# Altium project HU_revB.PrjPcb (part 3 of 4)

## Sheet MCP2515_PINOUT.SchDoc
size A; SheetNumber: 7; SheetTotal: 17
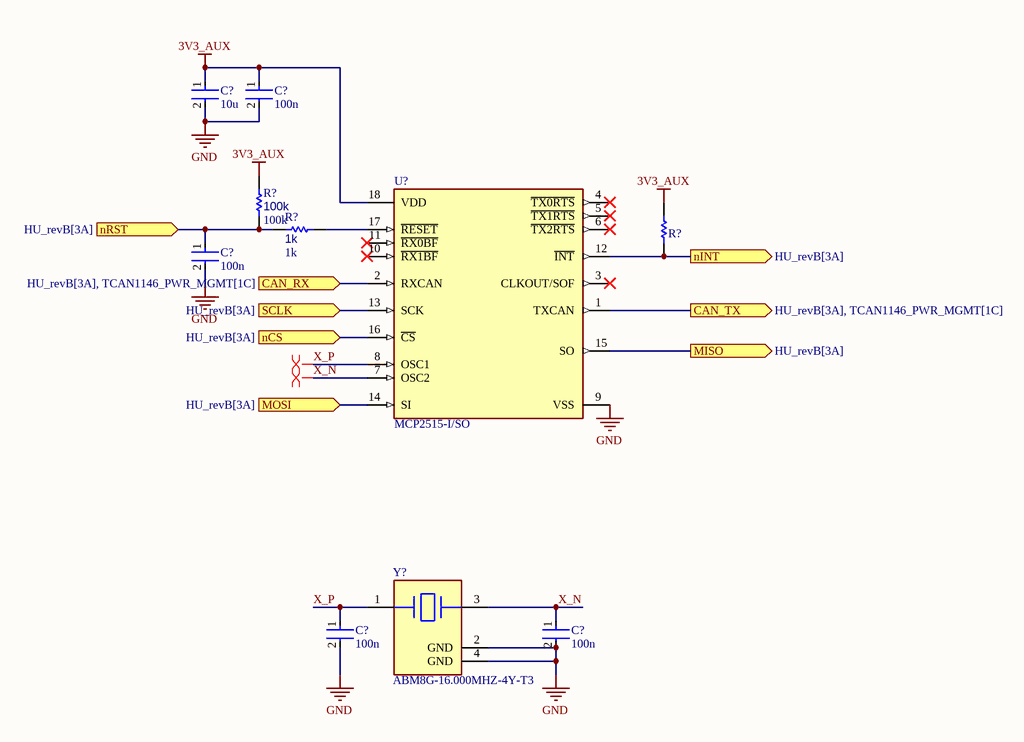
[diagram p8: MCP2515_PINOUT.SchDoc]

### Parts
C55  10u  [FP-0402-L_1_0_0_05-W_0_5-IPC_A]
C56  100n  [FP-0402-L_1_0_0_05-W_0_5-IPC_A]
C57  100n  [FP-0402-L_1_0_0_05-W_0_5-IPC_A]
C58  100n  [FP-0402-L_1_0_0_05-W_0_5-IPC_A]
C59  100n  [FP-0402-L_1_0_0_05-W_0_5-IPC_A]
R62  100k  [R0603B]
R64  1k  [R0603B]
R65  ERJ3EKF1002V  [RESC1609X55X30LL15T15]  (value not drawn)
U6  MCP2515-I/SO  [FP-C04-051-MFG]
Y3  ABM8G-16.000MHZ-4Y-T3  [FP-ABM8G-MFG]

### Ports
CAN_RX (in, see HU_revB[3A], TCAN1146_PWR_MGMT[1C]), CAN_TX (out, see HU_revB[3A], TCAN1146_PWR_MGMT[1C]), MISO (out, see HU_revB[3A]), MOSI (in, see HU_revB[3A]), nCS (in, see HU_revB[3A]), nINT (out, see HU_revB[3A]), nRST (in, see HU_revB[3A]), SCLK (in, see HU_revB[3A])

### Nets
3V3_AUX: C55.1 C56.1 R62.1 R65.1 U6.18(VDD)  [project net GPIO_VREF]
GND: C55.2 C56.2 C57.2 C58.2 C59.2 U6.9(VSS) Y3.2(GND) Y3.4(GND)
SPI0_MISO: U6.15(SO) ; port MISO
SPI0_MOSI: U6.14(SI) ; port MOSI
SPI0_nCS0: U6.16(~{CS}) ; port nCS
SPI0_SCLK: U6.13(SCK) ; port SCLK
X_N: C59.1 U6.7(OSC2) Y3.3
X_P: C58.1 U6.8(OSC1) Y3.1
NetC57_1: C57.1 R62.2 R64.2 ; port nRST
NetR64_1: R64.1 U6.17(~{RESET})
NetR65_2: R65.2 U6.12(~{INT}) ; port nINT
NetU6_1: U6.1(TXCAN) ; port CAN_TX
NetU6_2: U6.2(RXCAN) ; port CAN_RX

Not connected (* = marked no-connect by the designer): U6 3(CLKOUT/SOF)* 4(~{TX0RTS})* 5(~{TX1RTS})* 6(~{TX2RTS})* 10(~{RX1BF})* 11(~{RX0BF})*

### Layout directives
differential pair: X_N, X_P

### Library data of the parts
C55-C59 = CMP-001-00058-1: LARGE PADS, 0402 CAP, CHANGE COMMENT TO MATCH REAL P/N; Capacitor Type: Ceramic; Min Operating Temperature: -55°C; Mounting Technology: Surface Mount; Pins: 2; Case/Package: 0402; RoHS Compliant: Yes; Max Operating Temperature: 85°C
R62 R64 = CMP-009-00002-14: Resistor
  R?#51: Value: 100k
  R?#53: Value: 1k
R65 = CMP-1012-00623-3: Chip Resistor, 10 KOhm, +/- 1%, 0.1 W, -55 to 155 degC, 0603 (1608 Metric), RoHS, Tape and Reel; Manufacturer: Panasonic; Voltage Rating: 75V; Case\/Package: 0603; Power Rating: 100mW; Resistance: 10KOhm; Temperature Coefficient: 100ppm\/degreesC; Number of Pins: 2; Package Reference: 603; Depth: 0.8mm; Mount: SurfaceMount; Package Description: 2-Pin Surface Mount Device, Body 1.6 x 0.85 mm; Datasheet Version: 02/2017; Length: 1.6mm; Lead Free: LeadFree; Height: 0.45mm; Number of Terminations: 2; Max Power Dissipation: 100mW; Min Operating Temperature: -55degC; Datasheet URL: https://industrial.panasonic.com/cdbs/www-data/pdf/RDA0000/AOA0000C304.pdf; Termination: SMD/SMT; Case Code (Metric): 1608; Case Code (Imperial): 0603; Tolerance: 1%; Max Operating Temperature: 155degC; RoHSCompliant: true; Voltage Rating (DC): 75V; Radiation Hardening: No; Packaging: TapeandReel; Composition: ThickFilm; Mounting Technology: SurfaceMount; Manufacturer URL: http://www.panasonic.com/; Width: 0.031inch; REACH SVHC: NoSVHC; Contact Plating: Tin; Military Standard: Not; Package Quantity: 1
U6 = CMP-0186-00133-3: IC CAN CONTROLLER W/SPI 18SOIC; Manufacturer: Microchip; Min Supply Voltage: 2.7V; Max Supply Voltage: 5.5V; Standoff Height: 0.1mm; Nominal Supply Current: 10mA; Interface: SPI,CAN; Lead Free: Yes; Digikey Description: IC CAN CONTROLLER W/SPI 18SOIC; Category: IC; RoHS: TRUE; Manufacturer Part Number: MCP2515-I/SO; ComponentLink2URL: http://ww1.microchip.com/downloads/en/DeviceDoc/MCP2515-Stand-Alone-CAN-Controller-with-SPI-20001801J.pdf; Mouser Description: CAN Interface IC W/ SPI Interface; Device Class L2: Interface ICs; Package: C04-051; Automotive: No; Function: Controller; Octopart: https://octopart.com/mcp2515-i%2Fso-microchip-430187; Temperature: -40°C to +85°C; Ipc Land Pattern Name: SOIC127P1030X265-18; Ambient Temperature Range Low: -65°C; Height: 2.65mm; Device Class L1: Integrated Circuits (ICs); Ambient Temperature Range High: +125°C; Footprint Url: http://ww1.microchip.com/downloads/en/DeviceDoc/18L_SOIC_Wide_7.50_SO_C04-0051D.pdf; Temperature Range Low: -40°C; Device Class L3: Controllers; Temperature Range High: +85°C; ComponentLink2Description: Datasheet
Y3 = CMP-27762-015134-1: Crystal 16MHz ±30ppm (Tol) ±30ppm (Stability) 10pF FUND 80Ω 4-Pin SMD T/R; Series Resistance: 80R; Mount: Surface Mount; Width: 0.098inch; Load Capacitance: 10pF; Length: 3.2mm; Series: ABM8G; Max Operating Temperature: 60°C; Depth: 2.5mm; Frequency: 16MHz; Frequency Tolerance: 30ppm; Height: 0.039inch; ESR (Equivalent Series Resistance): 80R; Case/Package: SMD/SMT; Lead Free: Lead Free; Frequency Stability: 30ppm; Packaging: Tape and Reel; Number of Pins: 4; REACH SVHC: No SVHC; Min Operating Temperature: -10°C

## Sheet ADC108S022_PINOUT.SchDoc
size A; SheetNumber: 8; SheetTotal: 17
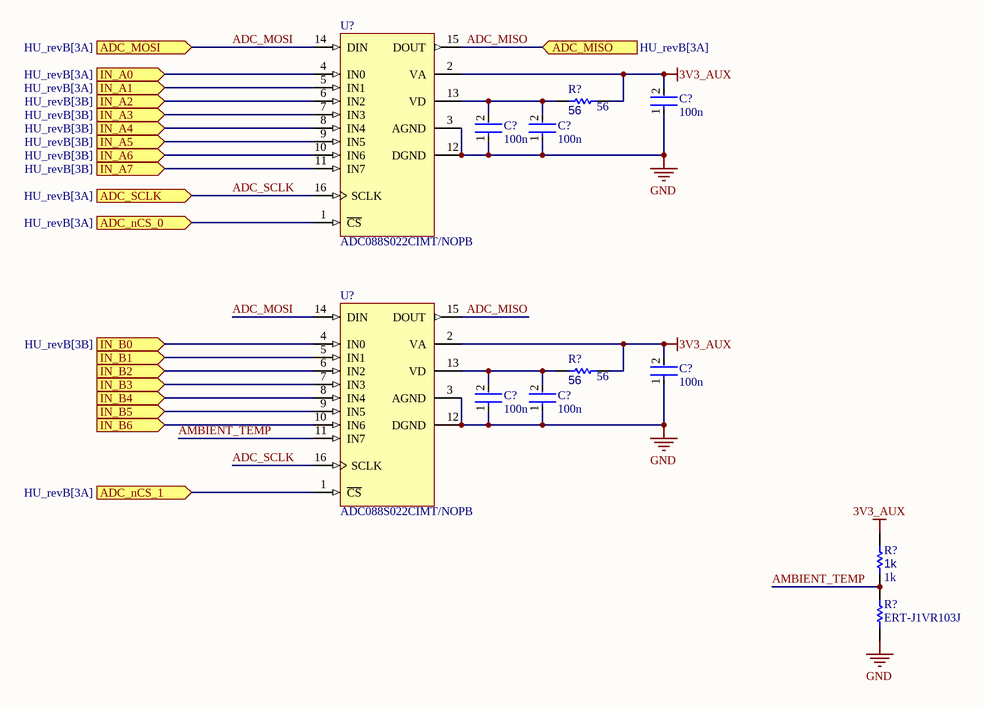
[diagram p9: ADC108S022_PINOUT.SchDoc]

### Parts
C60  100n  [FP-0402-L_1_0_0_05-W_0_5-IPC_A]
C61  100n  [FP-0402-L_1_0_0_05-W_0_5-IPC_A]
C62  100n  [FP-0402-L_1_0_0_05-W_0_5-IPC_A]
C63  100n  [FP-0402-L_1_0_0_05-W_0_5-IPC_A]
C64  100n  [FP-0402-L_1_0_0_05-W_0_5-IPC_A]
C65  100n  [FP-0402-L_1_0_0_05-W_0_5-IPC_A]
R66  56  [R0603B]
R67  56  [R0603B]
R68  1k  [R0603B]
R70  ERT-J1VR103J  [RESC1608X90X30ML15T20]
U9  ADC088S022CIMT/NOPB  [MTC16_L]
U10  ADC088S022CIMT/NOPB  [MTC16_L]

### Ports
ADC_MISO (in, see HU_revB[3A]), ADC_MOSI (in, see HU_revB[3A]), ADC_nCS_0 (in, see HU_revB[3A]), ADC_nCS_1 (in, see HU_revB[3A]), ADC_SCLK (in, see HU_revB[3A]), IN_A0 (in, see HU_revB[3A]), IN_A1 (in, see HU_revB[3A]), IN_A2 (in, see HU_revB[3B]), IN_A3 (in, see HU_revB[3B]), IN_A4 (in, see HU_revB[3B]), IN_A5 (in, see HU_revB[3B]), IN_A6 (in, see HU_revB[3B]), IN_A7 (in, see HU_revB[3B]), IN_B0 (in, see HU_revB[3B]), IN_B1 (in), IN_B2 (in), IN_B3 (in), IN_B4 (in), IN_B5 (in), IN_B6 (in)

### Nets
3V3_AUX: C60.2 C63.2 R66.1 R67.1 R68.1 U9.2(VA) U10.2(VA)  [project net GPIO_VREF]
GND: C60.1 C61.1 C62.1 C63.1 C64.1 C65.1 R70.1 U9.3(AGND) U9.12(DGND) U10.3(AGND) U10.12(DGND)
ADC_MISO: U9.15(DOUT) U10.15(DOUT) ; port ADC_MISO
ADC_MOSI: U9.14(DIN) U10.14(DIN) ; port ADC_MOSI
ADC_SCLK: U9.16(SCLK) U10.16(SCLK) ; port ADC_SCLK
AMBIENT_TEMP: R68.2 R70.2 U10.11(IN7)
AMP_I_SENSE: U10.4(IN0) ; port IN_B0
SPI1_nCS0: U9.1(~{CS}) ; port ADC_nCS_0
SPI1_nCS1: U10.1(~{CS}) ; port ADC_nCS_1
NetC61_2: C61.2 C62.2 R66.2 U9.13(VD)
NetC64_2: C64.2 C65.2 R67.2 U10.13(VD)
NetD45_1: U9.4(IN0) ; port IN_A0
NetR40_2: U9.8(IN4) ; port IN_A4
NetR44_1: U9.7(IN3) ; port IN_A3
NetR46_1: U9.6(IN2) ; port IN_A2
NetR63_1: U9.5(IN1) ; port IN_A1
NetR?#11_2: U9.11(IN7) ; port IN_A7
NetR?#15_1: U9.10(IN6) ; port IN_A6
NetR?#17_1: U9.9(IN5) ; port IN_A5
NetU10_5: U10.5(IN1) ; port IN_B1
NetU10_6: U10.6(IN2) ; port IN_B2
NetU10_7: U10.7(IN3) ; port IN_B3
NetU10_8: U10.8(IN4) ; port IN_B4
NetU10_9: U10.9(IN5) ; port IN_B5
NetU10_10: U10.10(IN6) ; port IN_B6

### Library data of the parts
C60-C65 = CMP-001-00058-1: as C55-C59 on sheet MCP2515_PINOUT; Min Operating Temperature: -55°C; Mounting Technology: Surface Mount; Pins: 2; Case/Package: 0402; RoHS Compliant: Yes; Max Operating Temperature: 85°C
R66-R68 = CMP-009-00002-14: Resistor
  R?#54 R?#55: Value: 56
  R?#56: Value: 1k
R70 = CMP-2000-00869-1: Manufacturer: Panasonic; Part Number: ERT-J1VR103J
U9 U10 = CMP-0054-00372-2: 8-Channel, 50 kSPS to 200 kSPS, 8-Bit A/D Converter, 16-pin TSSOP, Pb-Free; Manufacturer: National Semiconductor; PackageTopMarking: NSUZXYTT*88S022*CIMT; CompType: ADC IC; PowerWise: Y; ComponentLink2URL: http://www.national.com/pf/AD/ADC088S022.html; RoHS: Y; PackageDescription: Molded TSSOP, Jedec, 5 x 4.4 x 0.9mm Body, 16 Lead, 0.65mm Pitch; DatasheetVersion: Feb-2010; PinCount: 16; ComponentLink1Description: ADC088S022 Datasheet; Code_JEDEC: MO-153-AB; ComponentLink3URL: http://www.national.com/packaging/folders/mtc16.html; PackageVersion: revD, Jun-2003; ComponentLink3Description: MTC16 Package Page; RevisionNote: Component URLs added; ComponentLink1URL: http://www.national.com/ds/AD/ADC088S022.pdf; ComponentLink2Description: ADC088S022 Web Page; PackageReference: MTC16

## Sheet SD.SchDoc
size A4; SheetNumber: 9; SheetTotal: 17
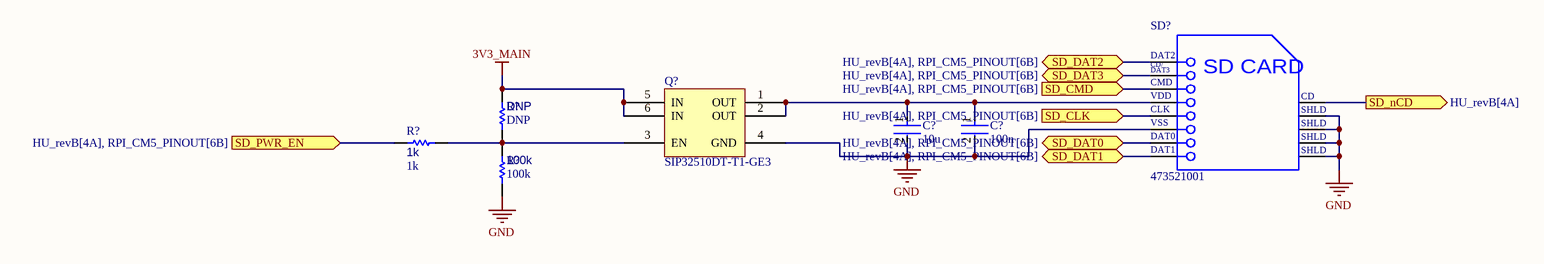
[diagram p10: SD.SchDoc]

### Parts
(Parts that share a designator on the sheet are numbered #1, #2 ... from top to bottom, then left to right.)
C66  10u  [FP-0402-L_1_0_0_05-W_0_5-IPC_A]
C67  100n  [FP-0402-L_1_0_0_05-W_0_5-IPC_A]
Q10  SIP32510DT-T1-GE3  [SOT95P284X110-6N]
R71  DNP  [R0603B]
R?#5  1k  [R0603B]
R?#6  100k  [R0603B]
SD1  473521001  [MOLX-473521001_V]

### Ports
SD_CLK (in, see HU_revB[4A], RPI_CM5_PINOUT[6B]), SD_CMD (in, see HU_revB[4A], RPI_CM5_PINOUT[6B]), SD_DAT0 (bidir, see HU_revB[4A], RPI_CM5_PINOUT[6B]), SD_DAT1 (bidir, see HU_revB[4A], RPI_CM5_PINOUT[6B]), SD_DAT2 (bidir, see HU_revB[4A], RPI_CM5_PINOUT[6B]), SD_DAT3 (bidir, see HU_revB[4A], RPI_CM5_PINOUT[6B]), SD_nCD (out, see HU_revB[4A]), SD_PWR_EN (in, see HU_revB[4A], RPI_CM5_PINOUT[6B])

### Nets
3V3_MAIN: Q10.5(IN) Q10.6(IN) R71.2
GND: C66.2 C67.2 Q10.4(GND) R?#6.1 SD1.6(VSS) SD1.10(SHLD) SD1.11(SHLD) SD1.12(SHLD) SD1.13(SHLD)
SD_CLK: SD1.5(CLK) ; port SD_CLK
SD_CMD: SD1.3(CMD) ; port SD_CMD
SD_DAT0: SD1.7(DAT0) ; port SD_DAT0
SD_DAT1: SD1.8(DAT1) ; port SD_DAT1
SD_DAT2: SD1.1(DAT2) ; port SD_DAT2
SD_DAT3: SD1.2(CD/DAT3) ; port SD_DAT3
SD_PWR_EN: R?#5.2 ; port SD_PWR_EN
NetC66_1: C66.1 C67.1 Q10.1(OUT) Q10.2(OUT) SD1.4(VDD)
NetQ10_3: Q10.3(EN) R71.1 R?#5.1 R?#6.2
NetSD1_9: SD1.9(CD) ; port SD_nCD

### Notes on the sheet
- (in symbol CMP-2000-05848-1) CD/; DAT3; SD CARD

### Library data of the parts
C66 C67 = CMP-001-00058-1: as C55-C59 on sheet MCP2515_PINOUT; Min Operating Temperature: -55°C; Mounting Technology: Surface Mount; Pins: 2; Case/Package: 0402; RoHS Compliant: Yes; Max Operating Temperature: 85°C
Q10 = CMP-019-00054-1: Power Switch ICs – Power Distribution; VISHAY; SIP32510DT-T1-GE3; 1; 1; 5.5 V; SOT-23-6; Max Supply Voltage: 5.5V; Max Power Dissipation: 833mW; Min Supply Voltage: 1.2V; Case/Package: SOT-23-6; Mounting Technology: Surface Mount; Max Operating Temperature: 85°C; Min Operating Temperature: -40°C
R71 R?#5 R?#6 = CMP-009-00002-14: Resistor
  R?#58: Value: DNP
  R?#59: Value: 1k
  R?#60: Value: 100k
SD1 = CMP-2000-05848-1: MicroSD(TM), Pitch 1.1 mm, 8 Position, Height 1.88 mm, -20 to 85 degC, RoHS, Tape and Reel; Manufacturer: Molex; Datasheet Version: Rev. G, 01/2012; Datasheet URL: http://www.molex.com/pdm_docs/sd/473521001_sd.pdf; Package Reference: 473521001; Manufacturer URL: http://www.molex.com/; Mounting Technology: SurfaceMount; Package Description: MicroSD(TM), Pitch 1.1 mm, 8 Position, Height 1.88 mm

## Sheet USB.SchDoc
size A4; SheetNumber: 10; SheetTotal: 17
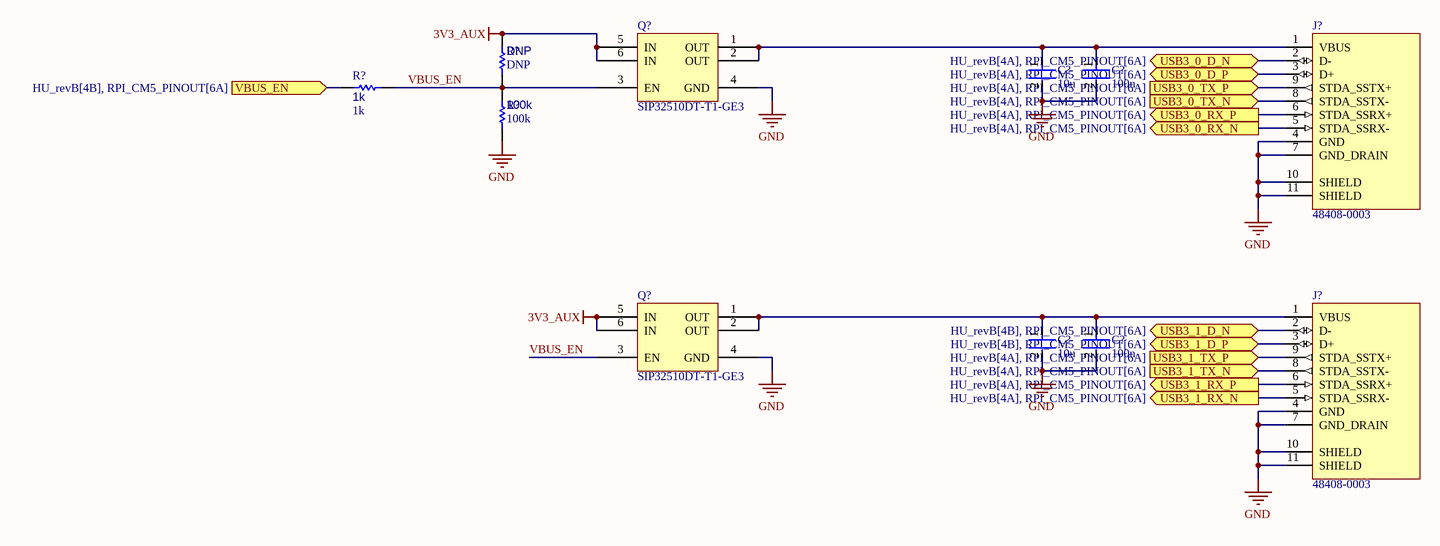
[diagram p11: USB.SchDoc]

### Parts
(Parts that share a designator on the sheet are numbered #1, #2 ... from top to bottom, then left to right.)
C68  10u  [FP-0402-L_1_0_0_05-W_0_5-IPC_A]
C69  100n  [FP-0402-L_1_0_0_05-W_0_5-IPC_A]
C70  10u  [FP-0402-L_1_0_0_05-W_0_5-IPC_A]
C71  100n  [FP-0402-L_1_0_0_05-W_0_5-IPC_A]
J11  48408-0003  [MOLX-48408-0003_V]
J12  48408-0003  [MOLX-48408-0003_V]
Q11  SIP32510DT-T1-GE3  [SOT95P284X110-6N]
Q12  SIP32510DT-T1-GE3  [SOT95P284X110-6N]
R72  DNP  [R0603B]
R73  1k  [R0603B]
R?#7  100k  [R0603B]

### Ports
USB3_0_D_N (bidir, see HU_revB[4A], RPI_CM5_PINOUT[6A]), USB3_0_D_P (bidir, see HU_revB[4A], RPI_CM5_PINOUT[6A]), USB3_0_RX_N (out, see HU_revB[4A], RPI_CM5_PINOUT[6A]), USB3_0_RX_P (out, see HU_revB[4A], RPI_CM5_PINOUT[6A]), USB3_0_TX_N (in, see HU_revB[4A], RPI_CM5_PINOUT[6A]), USB3_0_TX_P (in, see HU_revB[4A], RPI_CM5_PINOUT[6A]), USB3_1_D_N (bidir, see HU_revB[4B], RPI_CM5_PINOUT[6A]), USB3_1_D_P (bidir, see HU_revB[4B], RPI_CM5_PINOUT[6A]), USB3_1_RX_N (out, see HU_revB[4A], RPI_CM5_PINOUT[6A]), USB3_1_RX_P (out, see HU_revB[4A], RPI_CM5_PINOUT[6A]), USB3_1_TX_N (in, see HU_revB[4A], RPI_CM5_PINOUT[6A]), USB3_1_TX_P (in, see HU_revB[4A], RPI_CM5_PINOUT[6A]), VBUS_EN (in, see HU_revB[4B], RPI_CM5_PINOUT[6A])

### Nets
3V3_AUX: Q11.5(IN) Q11.6(IN) Q12.5(IN) Q12.6(IN) R72.2  [project net GPIO_VREF]
GND: C68.2 C69.2 C70.2 C71.2 J11.4(GND) J11.7(GND_DRAIN) J11.10(SHIELD) J11.11(SHIELD) J12.4(GND) J12.7(GND_DRAIN) J12.10(SHIELD) J12.11(SHIELD) Q11.4(GND) Q12.4(GND) R?#7.1
USB3_0_D_N: J11.2(D-) ; port USB3_0_D_N
USB3_0_D_P: J11.3(D+) ; port USB3_0_D_P
USB3_0_RX_N: J11.5(STDA_SSRX-) ; port USB3_0_RX_N
USB3_0_RX_P: J11.6(STDA_SSRX+) ; port USB3_0_RX_P
USB3_0_TX_N: J11.8(STDA_SSTX-) ; port USB3_0_TX_N
USB3_0_TX_P: J11.9(STDA_SSTX+) ; port USB3_0_TX_P
USB3_1_D_N: J12.2(D-) ; port USB3_1_D_N
USB3_1_D_P: J12.3(D+) ; port USB3_1_D_P
USB3_1_RX_N: J12.5(STDA_SSRX-) ; port USB3_1_RX_N
USB3_1_RX_P: J12.6(STDA_SSRX+) ; port USB3_1_RX_P
USB3_1_TX_N: J12.8(STDA_SSTX-) ; port USB3_1_TX_N
USB3_1_TX_P: J12.9(STDA_SSTX+) ; port USB3_1_TX_P
VBUS_EN: R73.2 ; port VBUS_EN
VBUS_EN: Q11.3(EN) Q12.3(EN) R72.1 R73.1 R?#7.2  [a separate net that carries the same name]
NetC68_1: C68.1 C69.1 J11.1(VBUS) Q11.1(OUT) Q11.2(OUT)
NetC70_1: C70.1 C71.1 J12.1(VBUS) Q12.1(OUT) Q12.2(OUT)

### Library data of the parts
C68-C71 = CMP-001-00058-1: as C55-C59 on sheet MCP2515_PINOUT; Min Operating Temperature: -55°C; Mounting Technology: Surface Mount; Pins: 2; Case/Package: 0402; RoHS Compliant: Yes; Max Operating Temperature: 85°C
J11 J12 = CMP-0411-00003-1: Universal Serial Bus (USB 3.0) I/O Connector, Vertical, Type A, Through Hole, 9 Circuits, -20 to 85 degC, RoHS, Tray; No. of Positions: 9; No. of Rows: 2; Packing: Tray; Orientation: Vertical; ComponentLink3Description: Package Specification; ComponentLink2URL: http://www.molex.com/webdocs/datasheets/pdf/en-us/0484080003_IO_CONNECTORS.pdf; ComponentLink3URL: http://www.molex.com/pdm_docs/sd/484080003_sd.pdf; ComponentLink1Description: Manufacturer URL; PackageVersion: Rev. F, 12/2012; Mounting Technology: Through Hole; Temperature Min: -20 degC; ComponentLink2Description: Datasheet; PackageDescription: 9-Pin USB 3.0 I/O Receptacle, Vertical, Height 15.25 mm, Through Hole; PartNumber: 48408-0003; Temperature Max: 85 degC; RoHS: TRUE; ComponentLink1URL: http://www.molex.com/
Q11 Q12 = CMP-019-00054-1: as Q10 on sheet SD; Case/Package: SOT-23-6; Mounting Technology: Surface Mount; Max Operating Temperature: 85°C; Min Operating Temperature: -40°C
R72 R73 R?#7 = CMP-009-00002-14: Resistor
  R?#61: Value: DNP
  R?#62: Value: 1k
  R?#63: Value: 100k

## Sheet HDMI.SchDoc
size A4; SheetNumber: 11; SheetTotal: 17
Used 2 times, as channels DISP_0, DISP_1. Parts and nets are listed once, with the designators drawn on the sheet.
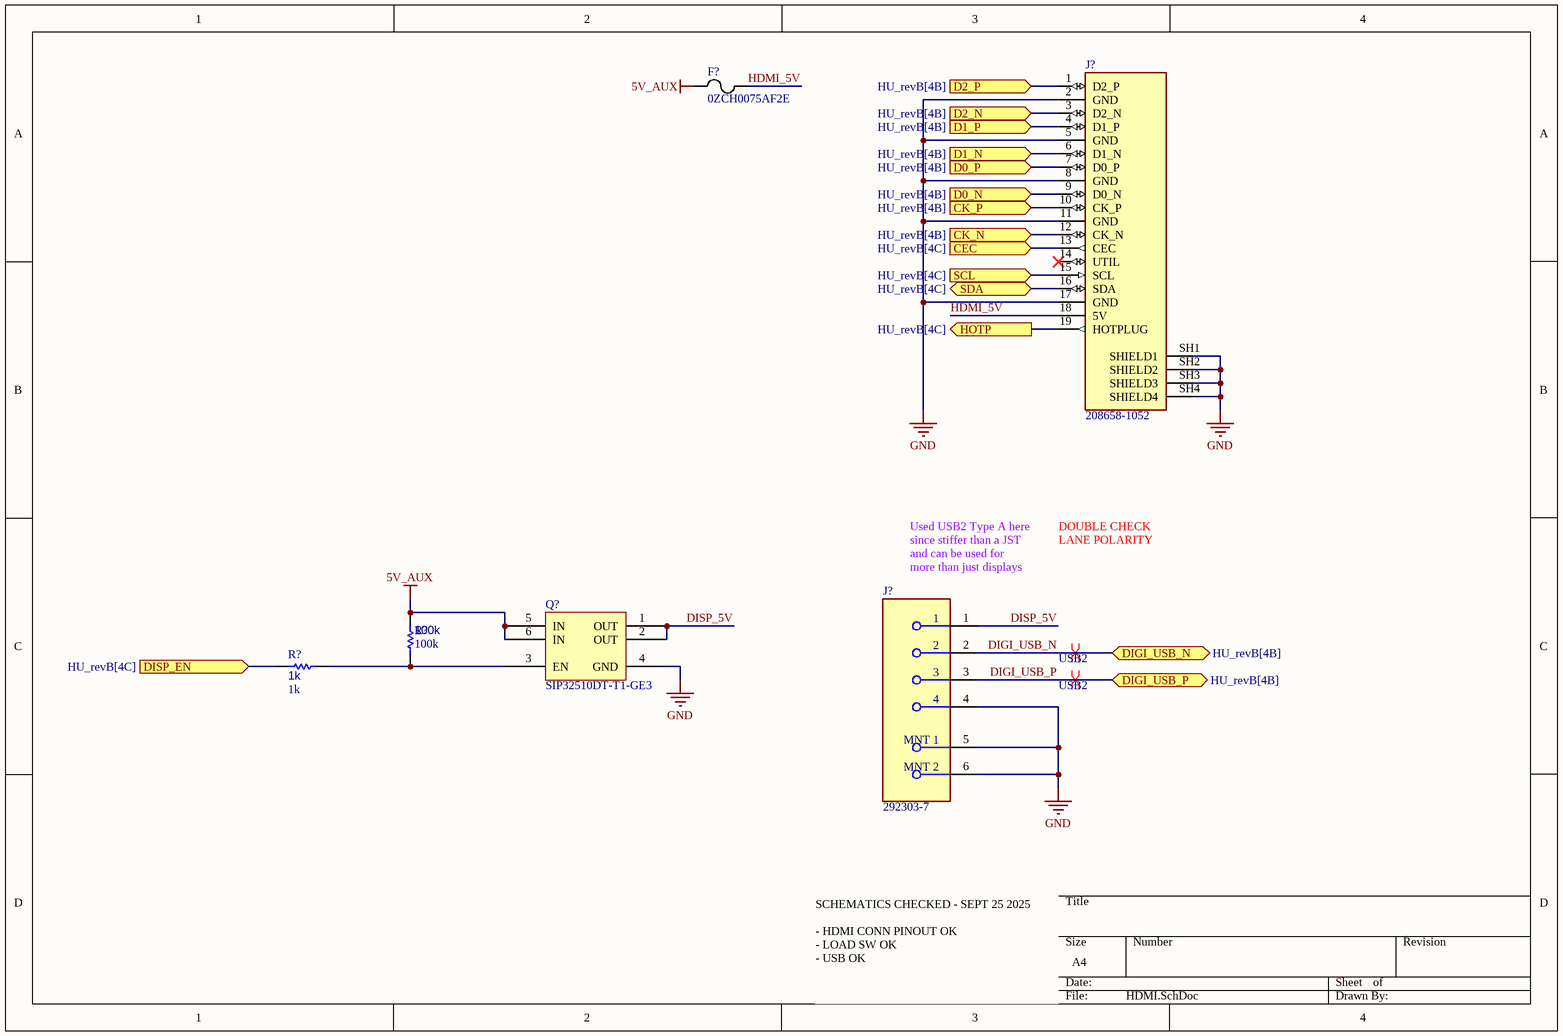
[diagram p12: HDMI.SchDoc]

### Parts
(Parts that share a designator on the sheet are numbered #1, #2 ... from top to bottom, then left to right.)
F?  0ZCH0075AF2E  [0ZCH0075AF2E-Footprint-1]
J?#1  208658-1052  [208658-1052-Footprint-1]
J?#2  292303-7  [FP-292303-7-MFG]
Q?  SIP32510DT-T1-GE3  [SOT95P284X110-6N]
R?#1  100k  [R0603B]
R?#2  1k  [R0603B]

### Ports
CEC (in, see HU_revB[4C]), CK_N (in, see HU_revB[4B]), CK_P (in, see HU_revB[4B]), D0_N (in, see HU_revB[4B]), D0_P (in, see HU_revB[4B]), D1_N (in, see HU_revB[4B]), D1_P (in, see HU_revB[4B]), D2_N (in, see HU_revB[4B]), D2_P (in, see HU_revB[4B]), DIGI_USB_N (bidir, see HU_revB[4B]), DIGI_USB_P (bidir, see HU_revB[4B]), DISP_EN (in, see HU_revB[4C]), HOTP (out, see HU_revB[4C]), SCL (in, see HU_revB[4C]), SDA (bidir, see HU_revB[4C])

### Nets
5V_AUX: F?.1 Q?.5(IN) Q?.6(IN) R?#1.2
GND: J?#1.2(GND) J?#1.5(GND) J?#1.8(GND) J?#1.11(GND) J?#1.17(GND) J?#1.SH1(SHIELD1) J?#1.SH2(SHIELD2) J?#1.SH3(SHIELD3) J?#1.SH4(SHIELD4) J?#2.4 J?#2.5(MNT_1) J?#2.6(MNT_2) Q?.4(GND)
CEC: J?#1.13(CEC) ; port CEC
CK_N: J?#1.12(CK_N) ; port CK_N
CK_P: J?#1.10(CK_P) ; port CK_P
D0_N: J?#1.9(D0_N) ; port D0_N
D0_P: J?#1.7(D0_P) ; port D0_P
D1_N: J?#1.6(D1_N) ; port D1_N
D1_P: J?#1.4(D1_P) ; port D1_P
D2_N: J?#1.3(D2_N) ; port D2_N
D2_P: J?#1.1(D2_P) ; port D2_P
DIGI_USB_N: J?#2.2 ; port DIGI_USB_N
DIGI_USB_P: J?#2.3 ; port DIGI_USB_P
DISP_5V: J?#2.1 Q?.1(OUT) Q?.2(OUT)
DISP_EN: R?#2.2 ; port DISP_EN
HDMI_5V: F?.2 J?#1.18(5V)
HOTP: J?#1.19(HOTPLUG) ; port HOTP
SCL: J?#1.15(SCL) ; port SCL
SDA: J?#1.16(SDA) ; port SDA
NetQ?_3: Q?.3(EN) R?#1.1 R?#2.1

Not connected (* = marked no-connect by the designer): J?#1 14(UTIL)*

### Channels
DISP_0: designators F?=F9_DISP_0 J?=J13_DISP_0 J?=J?_DISP_0 Q?=Q13_DISP_0 R?=R74_DISP_0 R?=R?_DISP_0; ports CEC=HDMI0_CEC CK_N=HDMI0_CK_N CK_P=HDMI0_CK_P D0_N=HDMI0_D0_N D0_P=HDMI0_D0_P D1_N=HDMI0_D1_N D1_P=HDMI0_D1_P D2_N=HDMI0_D2_N D2_P=HDMI0_D2_P DIGI_USB_N=DIGI_USB_N DIGI_USB_P=DIGI_USB_P DISP_EN=NetR?_DISP_0_2 HOTP=HDMI0_HOTP SCL=HDMI0_SCL SDA=HDMI0_SDA
DISP_1: designators F?=F9_DISP_1 J?=J13_DISP_1 J?=J?_DISP_1 Q?=Q13_DISP_1 R?=R74_DISP_1 R?=R?_DISP_1; ports CEC=HDMI1_CEC CK_N=HDMI1_CK_N CK_P=HDMI1_CK_P D0_N=HDMI1_D0_N D0_P=HDMI1_D0_P D1_N=HDMI1_D1_N D1_P=HDMI1_D1_P D2_N=HDMI1_D2_N D2_P=HDMI1_D2_P DIGI_USB_N=DIGI_USB_N DIGI_USB_P=DIGI_USB_P DISP_EN=NetR?_DISP_1_2 HOTP=HDMI1_HOTP SCL=HDMI1_SCL SDA=HDMI1_SDA

### Layout directives
differential pair; differential pair class USB2: DIGI_USB_N, DIGI_USB_P

### Notes on the sheet
- Used USB2 Type A here since stiffer than a JST and can be used for more than just displays
- DOUBLE CHECK LANE POLARITY
- SCHEMATICS CHECKED - SEPT 25 2025
  - HDMI CONN PINOUT OK
  - LOAD SW OK
  - USB OK

### Library data of the parts
F? = CMP-005-00028-2: PTC Thermistor; RoHS Compliant: Yes
J?#1 = CMP-002-00089-3: HDMI CONNECTOR, RCPT, 19POS, SMT; Available until stocks are exhausted Alternative available; Gender: Female; Min Operating Temperature: -20°C; Max Operating Temperature: 85°C; Pins: 19
J?#2 = CMP-03360-000008-1: CONN RCPT USB2.0 TYPEA 4P SMD RA; Manufacturer: TE Connectivity; Is Female: yes; Current Rating: 1A; Number Of Contacts: 4; Voltage Rating: 30V; Conn Orientation: Right Angle; Shielding: true; Digikey Description: CONN RCPT USB2.0 TYPEA 4P SMD RA; Manufacturer Part Number: 292303-7; Automotive: No; Category: Conn; Temperature: -55°C to +85°C; ComponentLink2Description: Datasheet; Mouser Description: USB Connectors USB A R/A Recpt Assy SMT; Contact Material: Gold,Nickel; Package: 292303-7; Device Class L3: unset; Octopart: https://octopart.com/292303-7-te+connectivity-42840369; RoHS: TRUE; Device Class L2: USB Connectors; ComponentLink2URL: https://www.te.com/usa-en/product-292303-7.html?te_bu=Cor&te_type=other&te_campaign=oct_glo_cor-oct-global-oth-prtnr-fy19-oct-octo-buy-bom_sma-298_2&elqCampaignId=35216; Temperature Range Low: -55°C; Usb Standard: USB 2.0; Temperature Range High: +85°C; Lead Free: Yes; Device Class L1: Connectors
Q? = CMP-019-00054-1: as Q10 on sheet SD; Case/Package: SOT-23-6; Mounting Technology: Surface Mount; Max Operating Temperature: 85°C; Min Operating Temperature: -40°C
R?#1 R?#2 = CMP-009-00002-14: Resistor
  R?#1: Value: 100k
  R?#2: Value: 1k

## Sheet TUSB2036_PINOUT.SchDoc
size B; SheetNumber: 12; SheetTotal: 17
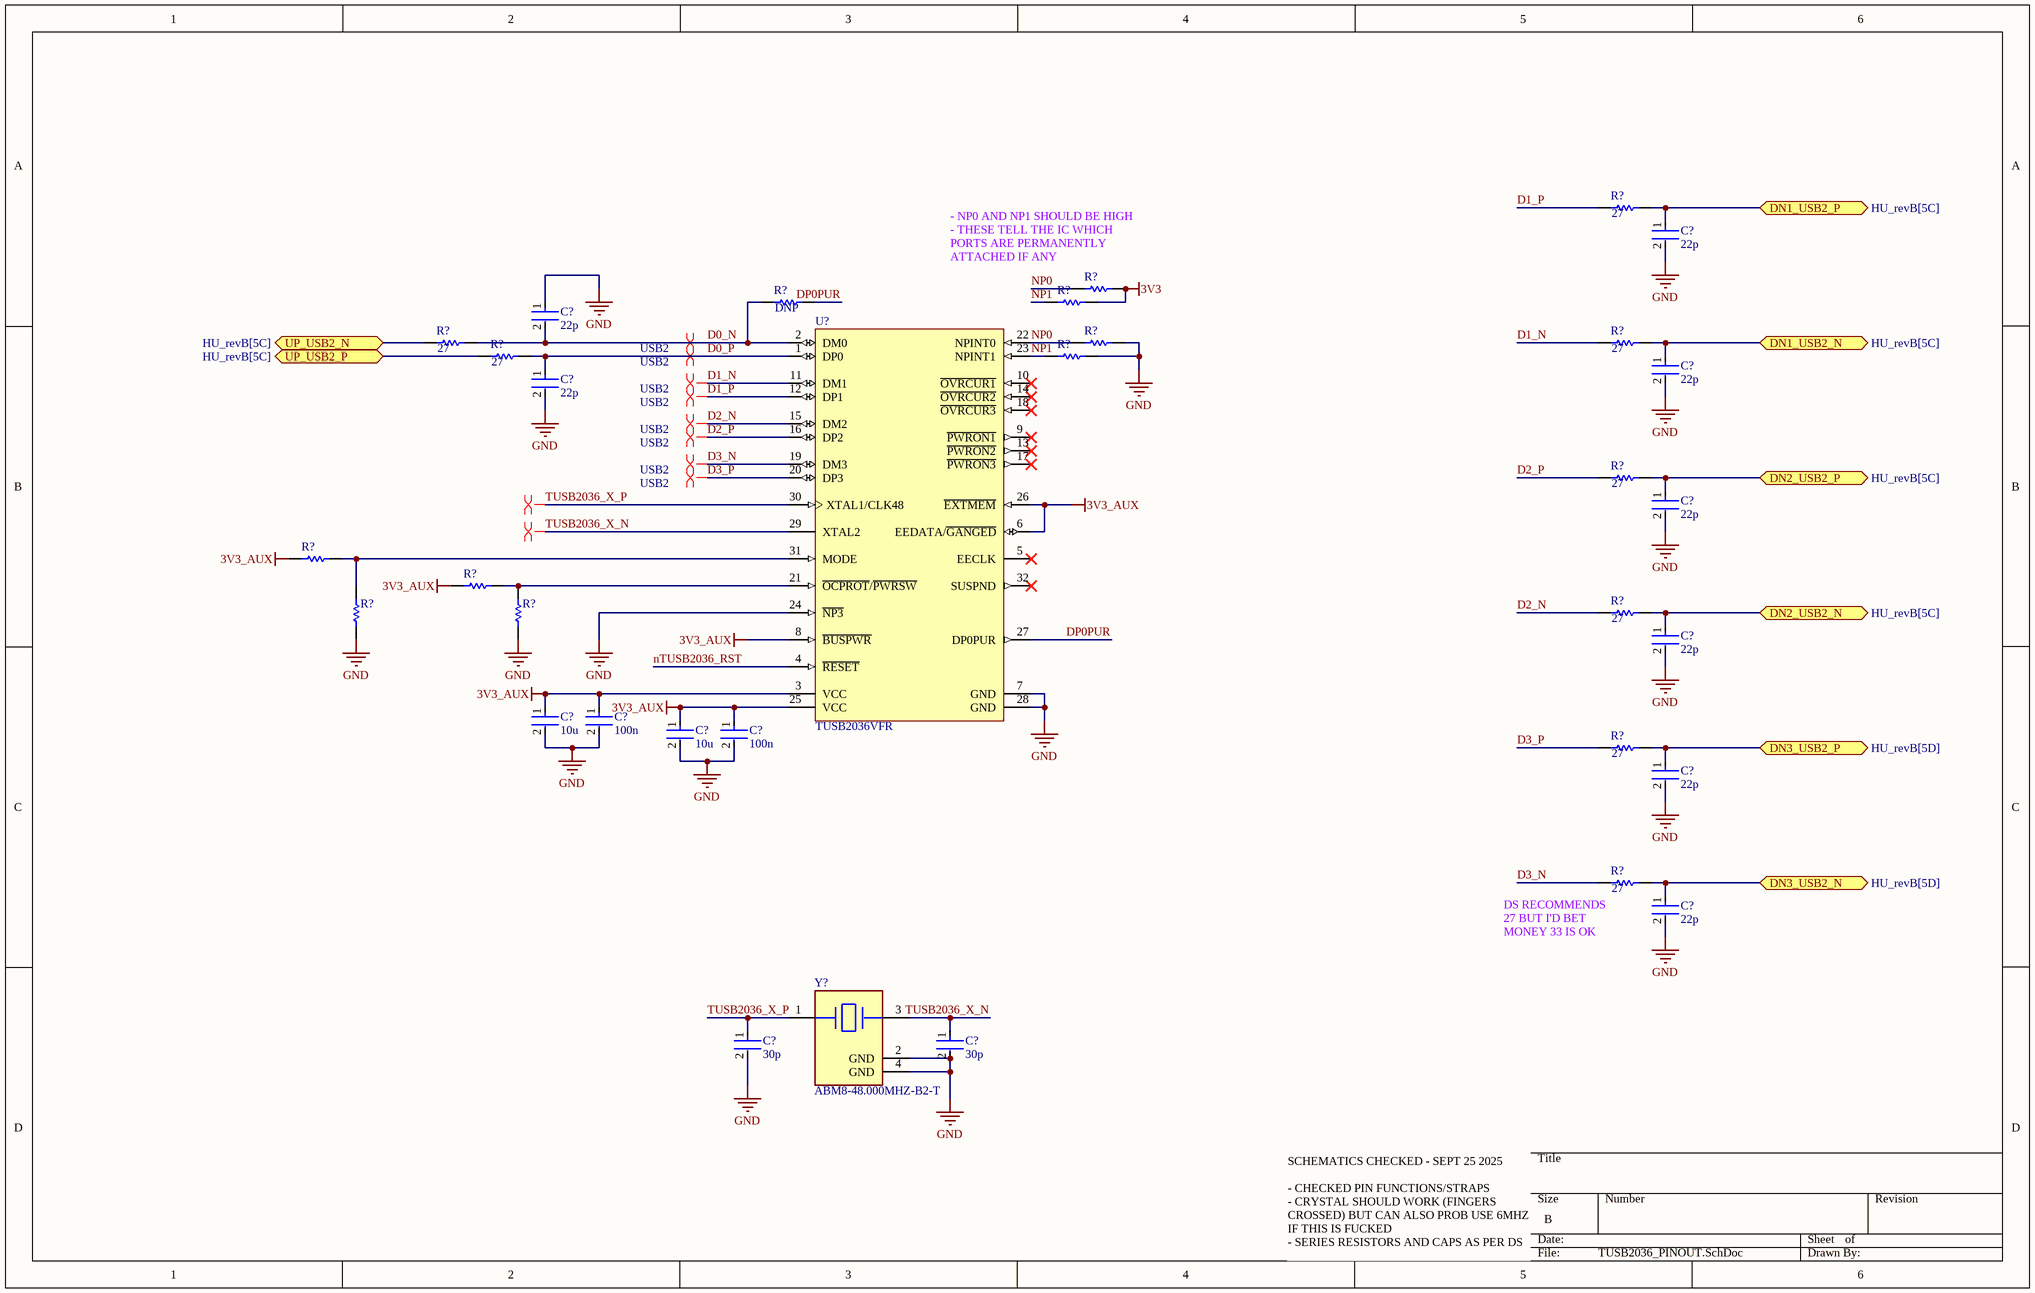
[diagram p13: TUSB2036_PINOUT.SchDoc]

### Parts
(Parts that share a designator on the sheet are numbered #1, #2 ... from top to bottom, then left to right.)
C72  22p  [FP-0402-L_1_0_0_05-W_0_5-IPC_A]
C73  22p  [FP-0402-L_1_0_0_05-W_0_5-IPC_A]
C74  22p  [FP-0402-L_1_0_0_05-W_0_5-IPC_A]
C75  22p  [FP-0402-L_1_0_0_05-W_0_5-IPC_A]
C76  22p  [FP-0402-L_1_0_0_05-W_0_5-IPC_A]
C77  22p  [FP-0402-L_1_0_0_05-W_0_5-IPC_A]
C78  10u  [FP-0402-L_1_0_0_05-W_0_5-IPC_A]
C79  100n  [FP-0402-L_1_0_0_05-W_0_5-IPC_A]
C80  10u  [FP-0402-L_1_0_0_05-W_0_5-IPC_A]
C81  100n  [FP-0402-L_1_0_0_05-W_0_5-IPC_A]
C82  22p  [FP-0402-L_1_0_0_05-W_0_5-IPC_A]
C85  22p  [FP-0402-L_1_0_0_05-W_0_5-IPC_A]
C?#8  30p  [FP-0402-L_1_0_0_05-W_0_5-IPC_A]
C?#9  30p  [FP-0402-L_1_0_0_05-W_0_5-IPC_A]
R75  27  [R0603B]
R76  0402 JUMPER  [RESC1005X40X25ML05T05]  (value not drawn)
R77  0402 JUMPER  [RESC1005X40X25ML05T05]  (value not drawn)
R78  27  [R0603B]
R79  0402 JUMPER  [RESC1005X40X25ML05T05]  (value not drawn)
R80  27  [R0603B]
R81  27  [R0603B]
R82  0402 JUMPER  [RESC1005X40X25ML05T05]  (value not drawn)
R83  27  [R0603B]
R84  DNP  [RESC1005X40X25ML05T05]  (value not drawn)
R85  DNP  [RESC1005X40X25ML05T05]  (value not drawn)
R86  27  [R0603B]
R87  27  [R0603B]
R88  27  [R0603B]
R?#8  DNP  [R0603B]
R?#9  0402 JUMPER  [RESC1005X40X25ML05T05]  (value not drawn)
R?#10  0402 JUMPER  [RESC1005X40X25ML05T05]  (value not drawn)
U11  TUSB2036VFR  [VF0032A_M]
Y?  ABM8-48.000MHZ-B2-T  [FP-ABM8-MFG]

### Ports
DN1_USB2_N (bidir, see HU_revB[5C]), DN1_USB2_P (bidir, see HU_revB[5C]), DN2_USB2_N (bidir, see HU_revB[5C]), DN2_USB2_P (bidir, see HU_revB[5C]), DN3_USB2_N (bidir, see HU_revB[5D]), DN3_USB2_P (bidir, see HU_revB[5D]), UP_USB2_N (bidir, see HU_revB[5C]), UP_USB2_P (bidir, see HU_revB[5C])

### Nets
3V3: R76.2 R77.2
3V3_AUX: C78.1 C79.1 C80.1 C81.1 R?#9.2 R?#10.2 U11.3(VCC) U11.6(EEDATA/~{GANGED}) U11.8(~{BUSPWR}) U11.25(VCC) U11.26(~{EXTMEM})  [project net GPIO_VREF]
GND: C72.2 C73.1 C74.2 C75.2 C76.2 C77.2 C78.2 C79.2 C80.2 C81.2 C82.2 C85.2 C?#8.2 C?#9.2 R79.2 R82.2 R84.1 R85.1 U11.7(GND) U11.24(~{NP3}) U11.28(GND) Y?.2(GND) Y?.4(GND)
D0_N: C73.2 R78.1 R?#8.2 U11.2(DM0)
D0_P: C75.1 R81.1 U11.1(DP0)
D1_N: R80.2 U11.11(DM1)
D1_P: R75.2 U11.12(DP1)
D2_N: R86.2 U11.15(DM2)
D2_P: R83.2 U11.16(DP2)
D3_N: R88.2 U11.19(DM3)
D3_P: R87.2 U11.20(DP3)
DIGI_USB_N: C77.1 R86.1 ; port DN2_USB2_N
DIGI_USB_N: C74.1 R80.1 ; port DN1_USB2_N  [a separate net that carries the same name]
DIGI_USB_P: C76.1 R83.1 ; port DN2_USB2_P
DIGI_USB_P: C72.1 R75.1 ; port DN1_USB2_P  [a separate net that carries the same name]
DP0PUR: R?#8.1 U11.27(DP0PUR)
NP0: R76.1 R79.1 U11.22(NPINT0)
NP1: R77.1 R82.1 U11.23(NPINT1)
nTUSB2036_RST: U11.4(~{RESET})
TUSB2036_X_N: C?#9.1 U11.29(XTAL2) Y?.3
TUSB2036_X_P: C?#8.1 U11.30(XTAL1/CLK48) Y?.1
NetC82_1: C82.1 R87.1 ; port DN3_USB2_P
NetC85_1: C85.1 R88.1 ; port DN3_USB2_N
NetR78_2: R78.2 ; port UP_USB2_N
NetR81_2: R81.2 ; port UP_USB2_P
NetR84_2: R84.2 R?#9.1 U11.31(MODE)
NetR85_2: R85.2 R?#10.1 U11.21(~{OCPROT}/~{PWRSW})

Not connected (* = marked no-connect by the designer): U11 5(EECLK)* 9(~{PWRON1})* 10(~{OVRCUR1})* 13(~{PWRON2})* 14(~{OVRCUR2})* 17(~{PWRON3})* 18(~{OVRCUR3})* 32(SUSPND)*

### Layout directives
differential pair: TUSB2036_X_N, TUSB2036_X_P
differential pair; differential pair class USB2: D0_N, D0_P, D1_N, D1_P, D2_N, D2_P, D3_N, D3_P

### Notes on the sheet
- (near R76) - NP0 AND NP1 SHOULD BE HIGH
  - THESE TELL THE IC WHICH PORTS ARE PERMANENTLY ATTACHED IF ANY
- (near R88) DS RECOMMENDS 27 BUT I'D BET MONEY 33 IS OK
- SCHEMATICS CHECKED - SEPT 25 2025
  - CHECKED PIN FUNCTIONS/STRAPS
  - CRYSTAL SHOULD WORK (FINGERS CROSSED) BUT CAN ALSO PROB USE 6MHZ IF THIS IS FUCKED
  - SERIES RESISTORS AND CAPS AS PER DS

### Library data of the parts
C72-C82 C85 C?#8 C?#9 = CMP-001-00058-1: as C55-C59 on sheet MCP2515_PINOUT; Min Operating Temperature: -55°C; Mounting Technology: Surface Mount; Pins: 2; Case/Package: 0402; RoHS Compliant: Yes; Max Operating Temperature: 85°C
R75 R78 R80 R81 R83 R86-R88 R?#8 = CMP-009-00002-14: Resistor
  R?#64 R?#69 R?#71-R?#73 R?#76 R?#79 R?#80: Value: 27
  R?#67: Value: DNP
R76 R77 R79 R82 R84 R85 R?#9 R?#10 = CMP-009-00118-2: READ THE NAME; Pins: 2; Component Type: Standard; Design Item ID: CMP-009-00206-2; Source: 0402jump.SchLib
U11 = CMP-0309-00082-2: 2 / 3-Port Hub for USB with Optional Serial EEPROM Interface, 3.3V, 0 to 70 degC, 32-Pin LQFP (VF), Green (RoHS & no Sb/Br); Manufacturer: Texas Instruments; Supply Voltage(s)(V): 3.3; SubFamily: USB Hub Controller; USB Speed: Full; USB Full Speed: True; PackageReference: VF0032A; ComponentLink2URL: http://www.ti.com/litv/pdf/mtqf002b; PackageDescription: 32-Pin Plastic Quad Flatpack, 7 x 7 mm Body, 0.8 mm Pitch; Integrated MCU Architecture: N/A; DatasheetVersion: SLLS372E; ComponentLink1URL: http://www.ti.com/general/docs/lit/getliterature.tsp?genericPartNumber=TUSB2036&fileType=pdf; Eco-Plan: Green (RoHS & no Sb/Br); PartNumber: TUSB2036VFR; Mounting Technology: Surface Mount; ComponentLink1Description: Datasheet; PackageVersion: revD, Apr-2000; ComponentLink2Description: Package Specification
Y? = CMP-27762-011708-1: Crystal 48MHz ±20ppm 18pF SMD-4 3.2mm x 2.5mm; Series Resistance: 35R; Frequency Stability: 50ppm; Package Quantity: 1000; Packaging: Tape and Reel; Mount: Surface Mount; Length: 3.2mm; Load Capacitance: 18pF; Max Operating Temperature: 70°C; Operating Frequency: 48 MHz; RoHS Compliant: Yes; Series: ABM8; Frequency Tolerance: 20ppm; Lead Free: Lead Free; Min Operating Temperature: -20°C; Case/Package: CSMD; Number of Pins: 4; Height: 0.031inch; ESR (Equivalent Series Resistance): 35R; Frequency: 48MHz; Radiation Hardening: No; Width: 0.098inch; Tolerance: 20ppm; Termination: SMD/SMT; Depth: 2.5mm; Resistor Type: Ceramic; REACH SVHC: No SVHC

## Sheet 3V3_REG.SchDoc
size B; SheetNumber: 13; SheetTotal: 17
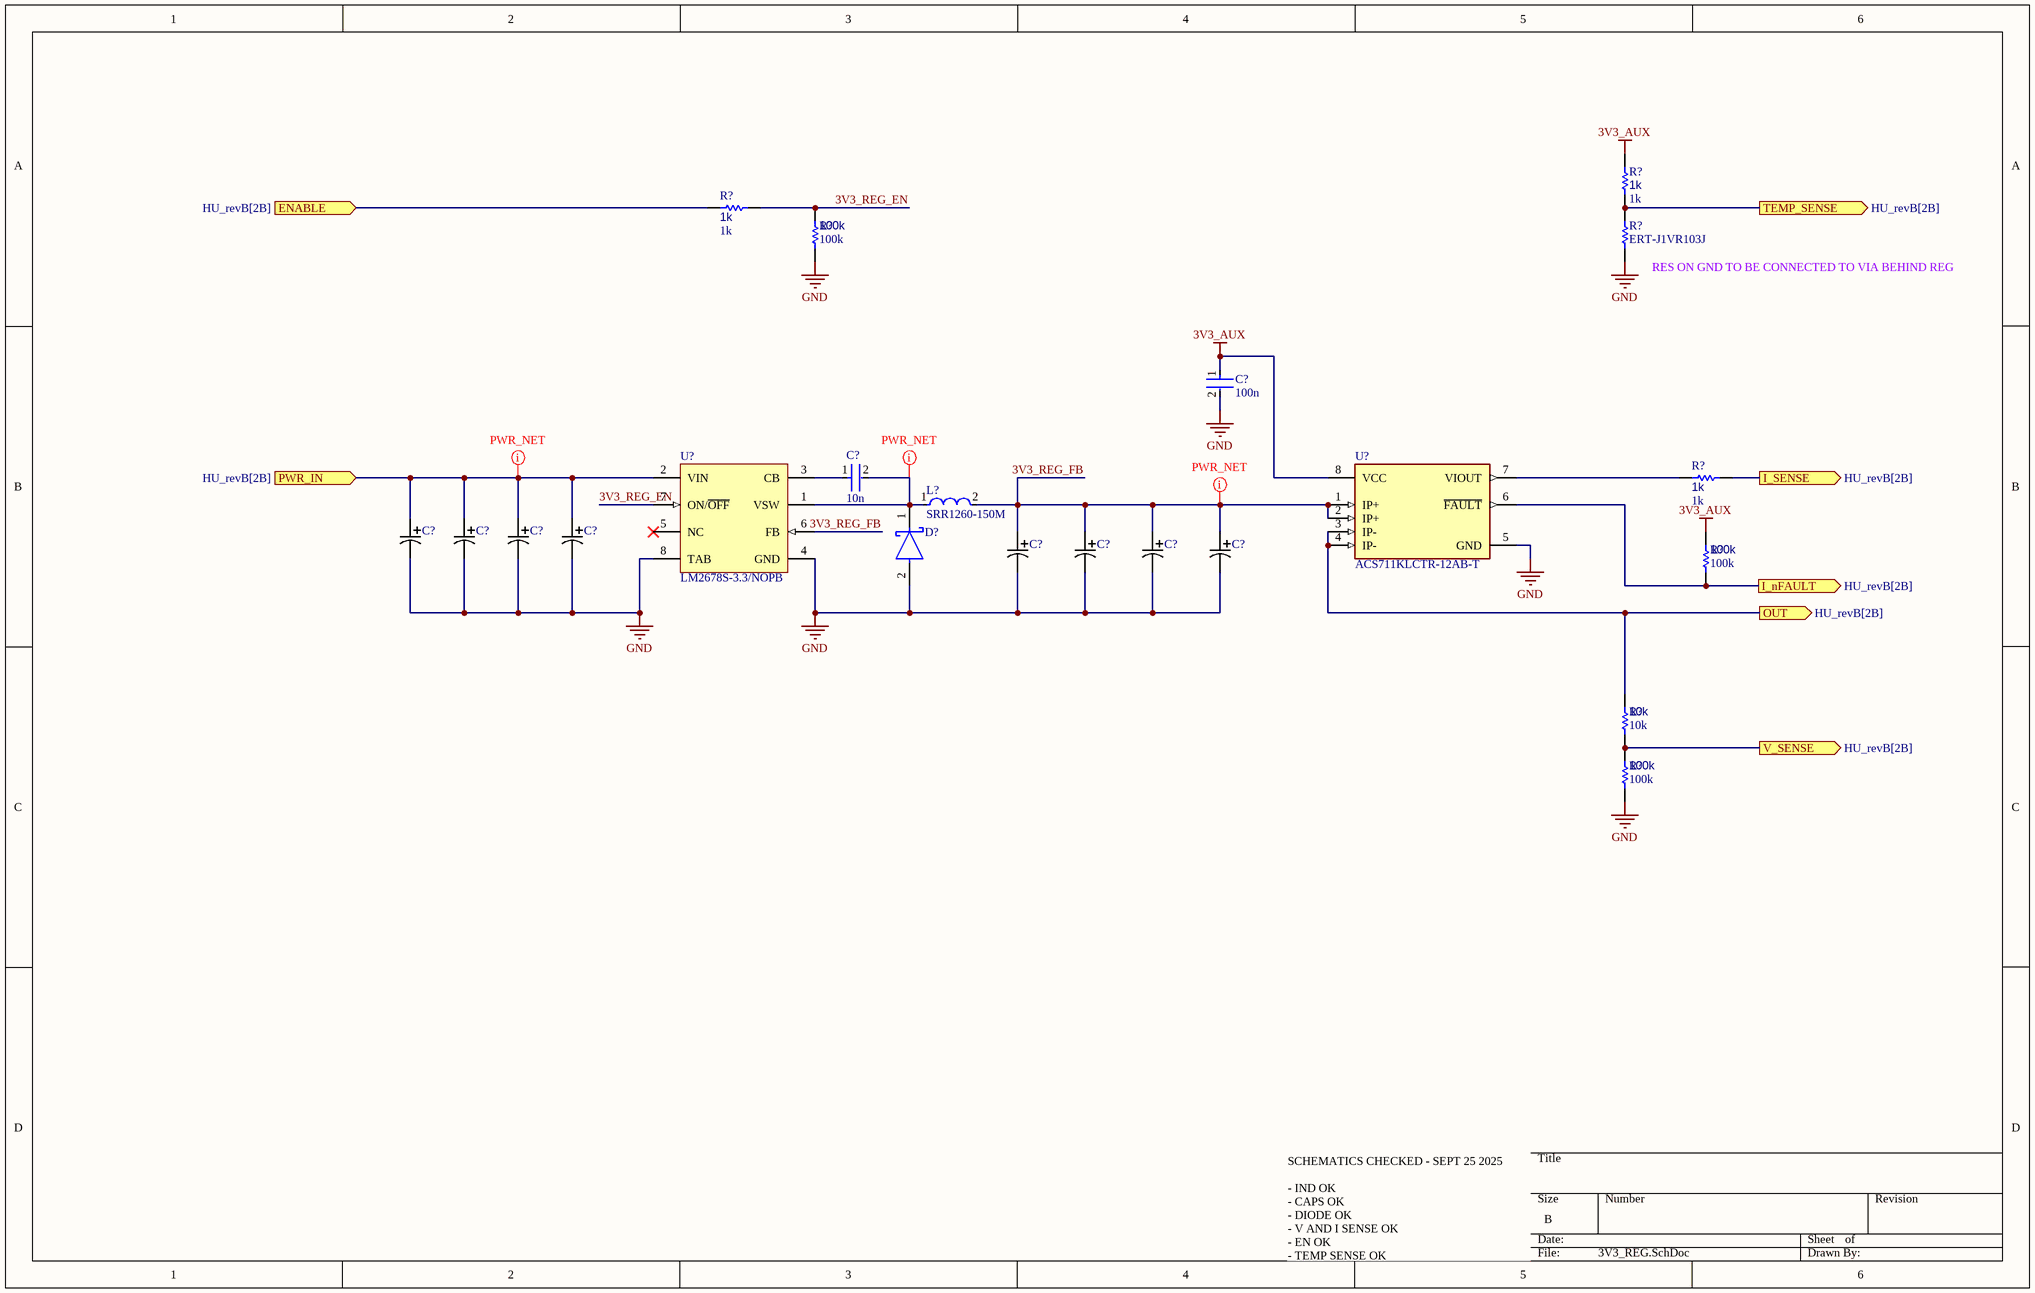
[diagram p14: 3V3_REG.SchDoc]

### Parts
(Parts that share a designator on the sheet are numbered #1, #2 ... from top to bottom, then left to right.)
C?#10  100n  [FP-0402-L_1_0_0_05-W_0_5-IPC_A]
C?#11  10n  [FP-0402-L_1_0_0_05-W_0_5-IPC_A]
C?#12  T495D475K050ATE300  [T495D475K050ATE300-Footprint-1]  (value not drawn)
C?#13  T495D475K050ATE300  [T495D475K050ATE300-Footprint-1]  (value not drawn)
C?#14  T495D475K050ATE300  [T495D475K050ATE300-Footprint-1]  (value not drawn)
C?#15  T495D475K050ATE300  [T495D475K050ATE300-Footprint-1]  (value not drawn)
C?#16  T495D337K010ATE150  [T495D337K010ATE150-Footprint-1]  (value not drawn)
C?#17  T495D337K010ATE150  [T495D337K010ATE150-Footprint-1]  (value not drawn)
C?#18  T495D337K010ATE150  [T495D337K010ATE150-Footprint-1]  (value not drawn)
C?#19  T495D337K010ATE150  [T495D337K010ATE150-Footprint-1]  (value not drawn)
D?  B540C-13-F  [FP-SMC-MFG]  (value not drawn)
L?#2  SRR1260-150M  [FP-SRR1260-MFG]
R?#11  1k  [R0603B]
R?#12  1k  [R0603B]
R?#13  100k  [R0603B]
R?#14  ERT-J1VR103J  [RESC1608X90X30ML15T20]
R?#15  1k  [R0603B]
R?#16  100k  [R0603B]
R?#17  10k  [R0603B]
R?#18  100k  [R0603B]
U?#1  LM2678S-3.3/NOPB  [KTW0007B_N]
U?#2  ACS711KLCTR-12AB-T  [FP-LC-8-IPC_C]

### Ports
ENABLE (in, see HU_revB[2B]), I_nFAULT (out, see HU_revB[2B]), I_SENSE (out, see HU_revB[2B]), OUT (out, see HU_revB[2B]), PWR_IN (in, see HU_revB[2B]), TEMP_SENSE (out, see HU_revB[2B]), V_SENSE (out, see HU_revB[2B])

### Nets
3V3_AUX: C?#10.1 R?#11.1 R?#16.2 R?#17.2 U?#2.3(IP-) U?#2.4(IP-) U?#2.8(VCC) ; port OUT  [project net GPIO_VREF]
GND: C?#10.2 C?#12.2 C?#13.2 C?#14.2 C?#15.2 C?#16.2 C?#17.2 C?#18.2 C?#19.2 D?.2(A) R?#13.1 R?#14.1 R?#18.1 U?#1.4(GND) U?#1.8(TAB) U?#2.5(GND)
3V3_EN: R?#12.2 ; port ENABLE
3V3_REG_EN: R?#12.1 R?#13.2 U?#1.7(ON/~{OFF})
3V3_REG_FB: C?#16.1 C?#17.1 C?#18.1 C?#19.1 L?#2.2 U?#1.6(FB) U?#2.1(IP+) U?#2.2(IP+)
NetC?#11_1: C?#11.1 U?#1.3(CB)
NetC?#11_2: C?#11.2 D?.1(C) L?#2.1 U?#1.1(VSW)
NetC?#12_1: C?#12.1 C?#13.1 C?#14.1 C?#15.1 U?#1.2(VIN) ; port PWR_IN
NetR?#11_2: R?#11.2 R?#14.2 ; port TEMP_SENSE
NetR?#15_1: R?#15.1 ; port I_SENSE
NetR?#15_2: R?#15.2 U?#2.7(VIOUT)
NetR?#16_1: R?#16.1 U?#2.6(~{FAULT}) ; port I_nFAULT
NetR?#17_1: R?#17.1 R?#18.2 ; port V_SENSE

Not connected (* = marked no-connect by the designer): U?#1 5(NC)*

### Layout directives
net class PWR: 3V3_REG_FB, NetC?#11_2, NetC?#12_1

### Notes on the sheet
- (near R?#14) RES ON GND TO BE CONNECTED TO VIA BEHIND REG
- SCHEMATICS CHECKED - SEPT 25 2025
  - IND OK
  - CAPS OK
  - DIODE OK
  - V AND I SENSE OK
  - EN OK
  - TEMP SENSE OK

### Library data of the parts
C?#10 C?#11 = CMP-001-00058-1: as C55-C59 on sheet MCP2515_PINOUT; Min Operating Temperature: -55°C; Mounting Technology: Surface Mount; Pins: 2; Case/Package: 0402; RoHS Compliant: Yes; Max Operating Temperature: 85°C
C?#12-C?#15 = CMP-001-00066-1: Cap Tant Solid 4.7uF 50V D CASE 10% (7.3 X 4.3 X 2.8mm) SMD 7343-31 0.3 Ohm 125 C T/R; Value: 4.7µF; Min Operating Temperature: -55°C; Voltage Rating: 50V; Tolerance: 10%; Mounting Technology: Surface Mount; Max Operating Temperature: 125°C; Case/Package: 7343-31; Pins: 2
C?#16-C?#19 = CMP-001-00067-1: 330uF Solid MnO2 Tantalum Capacitor, 10 V dc +/-10%, T495 Series; Tolerance: 10%; Voltage Rating: 10V; Value: 330µF; Case/Package: 2917; Min Operating Temperature: -55°C; Mounting Technology: Surface Mount; Max Operating Temperature: 125°C
D? = CMP-2000-05097-3: DIODE SCHOTTKY 40V 5A SMC; Manufacturer: Diodes Inc.; Automotive Grade: NA; Peak Reverse Current: 0.5mA; Value: 300pF; Max Junction Temp: +150°C; Max Surge Forward Current: 100A; Standoff Height: 0.1mm; Digikey Description: DIODE SCHOTTKY 40V 5A SMC; Temperature Range Low: -55°C; Manufacturer Part Number: B540C-13-F; Octopart: https://octopart.com/b540c-13-f-diodes+inc.-325873; Lead Free: Yes; Reverse Voltage: 40V; RoHS: TRUE; Category: Diode; Mouser Description: Diode: Schottky rectifying; SMD; 40V; 5A; SMC; Package: reel, tape; ComponentLink2Description: Datasheet; Temperature Range High: +150°C; Automotive: No; Footprint Url: https://www.diodes.com/assets/Package-Files/SMC.pdf; Device Class L3: Schottky Diodes; Height: 2.5mm; Forward Current: 5A; Temperature: -55°C to +150°C; Package: SMC; ComponentLink2URL: https://www.diodes.com/assets/Datasheets/ds13012.pdf; Device Class L2: Diodes; Max Repetitive Reverse Voltage: 40V; Device Class L1: Discrete Semiconductors; Capacitance: 300pF
L?#2 = CMP-2000-07146-2: FIXED IND 15UH 5A 27 MOHM SMD; Q Factor: 25; Sample Rate (Hz): 100kHz; Resistance: 27MR; Material: Steel; Inductance Tolerance: 20%; Frequency: 17.6MHz; Saturation Current: 4.6A; Core Material: Ferrite; Shielding: Shielded; Series: SRR1260; Termination: SMD/SMT; Packaging: Tape and Reel; RoHS Compliant: Yes; Height - Seated (Max): 0.256inch; Depth: 12.8mm; Case/Package: 1260; Inductance: 15uH; Height: 6mm; Number of Pins: 2; Mount: Surface Mount; Min Operating Temperature: -40°C; Test Frequency: 100kHz; Length: 12.5mm; Self Resonant Frequency: 17.6MHz; Current Rating: 5A; Tolerance: 20%; RMS Current (Irms): 5A; REACH SVHC: No SVHC; Resistor Type: Wirewound; DC Resistance (DCR): 27mR; Width: 12.5mm; Package Quantity: 600; DC Current: 5A; Max DC Current: 5A; Max Operating Temperature: 125°C; Military Standard: Not
R?#11-R?#13 R?#15-R?#18 = CMP-009-00002-14: Resistor
  R?#81 R?#82 R?#85: Value: 1k
  R?#83 R?#86 R?#88: Value: 100k
  R?#87: Value: 10k
R?#14 = CMP-2000-00869-1: Manufacturer: Panasonic; Part Number: ERT-J1VR103J
U?#1 = CMP-0069-00195-3: SIMPLE SWITCHER® High Efficiency 5A Step-Down Voltage Regulator, 7-pin TO-263, Pb-Free; Manufacturer: Texas Instruments; PackageTopMarking: NSUZXYTTE#*LM2678*S-3.3; PowerWise: N; PackageReference: KTW0007B; Code_JEDEC: MO-169-AC; CompType: Switcher; RoHS: Y; PackageDescription: TO-263, Molded, .400 x .390 x .180in Body, 7 Lead, .050in Pitch, Surface Mount; ComponentLink1Description: Datasheet URL; PinCount: 7; ComponentLink1URL: http://www.ti.com/general/docs/lit/getliterature.tsp?genericPartNumber=LM2678&fileType=pdf
U?#2 = CMP-1557-00012-2: SENSOR CURRENT HALL 12.5A AC/DC; Number of Channels: 1; Min Supply Voltage: 3V; Sensitivity: 110mV/A; Response Time: 4.6us; Operating Supply Voltage: 3.3V; Max Supply Voltage: 5.5V; Max Supply Current: 5.5mA; Bandwidth: 100kHz; Linearity: 1%; Quiescent Current: 4mA; Accuracy: 5%; Polarity: Bidirectional; Case/Package: SOIC; Packaging: Tape and Reel; Number of Pins: 8; Width: 3.9mm; Frequency: 100kHz; -3db Bandwidth: 100kHz; REACH SVHC: No SVHC; Series: -; Height: 1.5mm; Package Quantity: 1; Min Operating Temperature: -40°C; Max Operating Temperature: 125°C; Current Sensing: 12.5A; RoHS Compliant: Yes; Length: 4.9mm

## Sheet GMSL_DESERIALIZER.SchDoc
size C; SheetNumber: 14; SheetTotal: 17
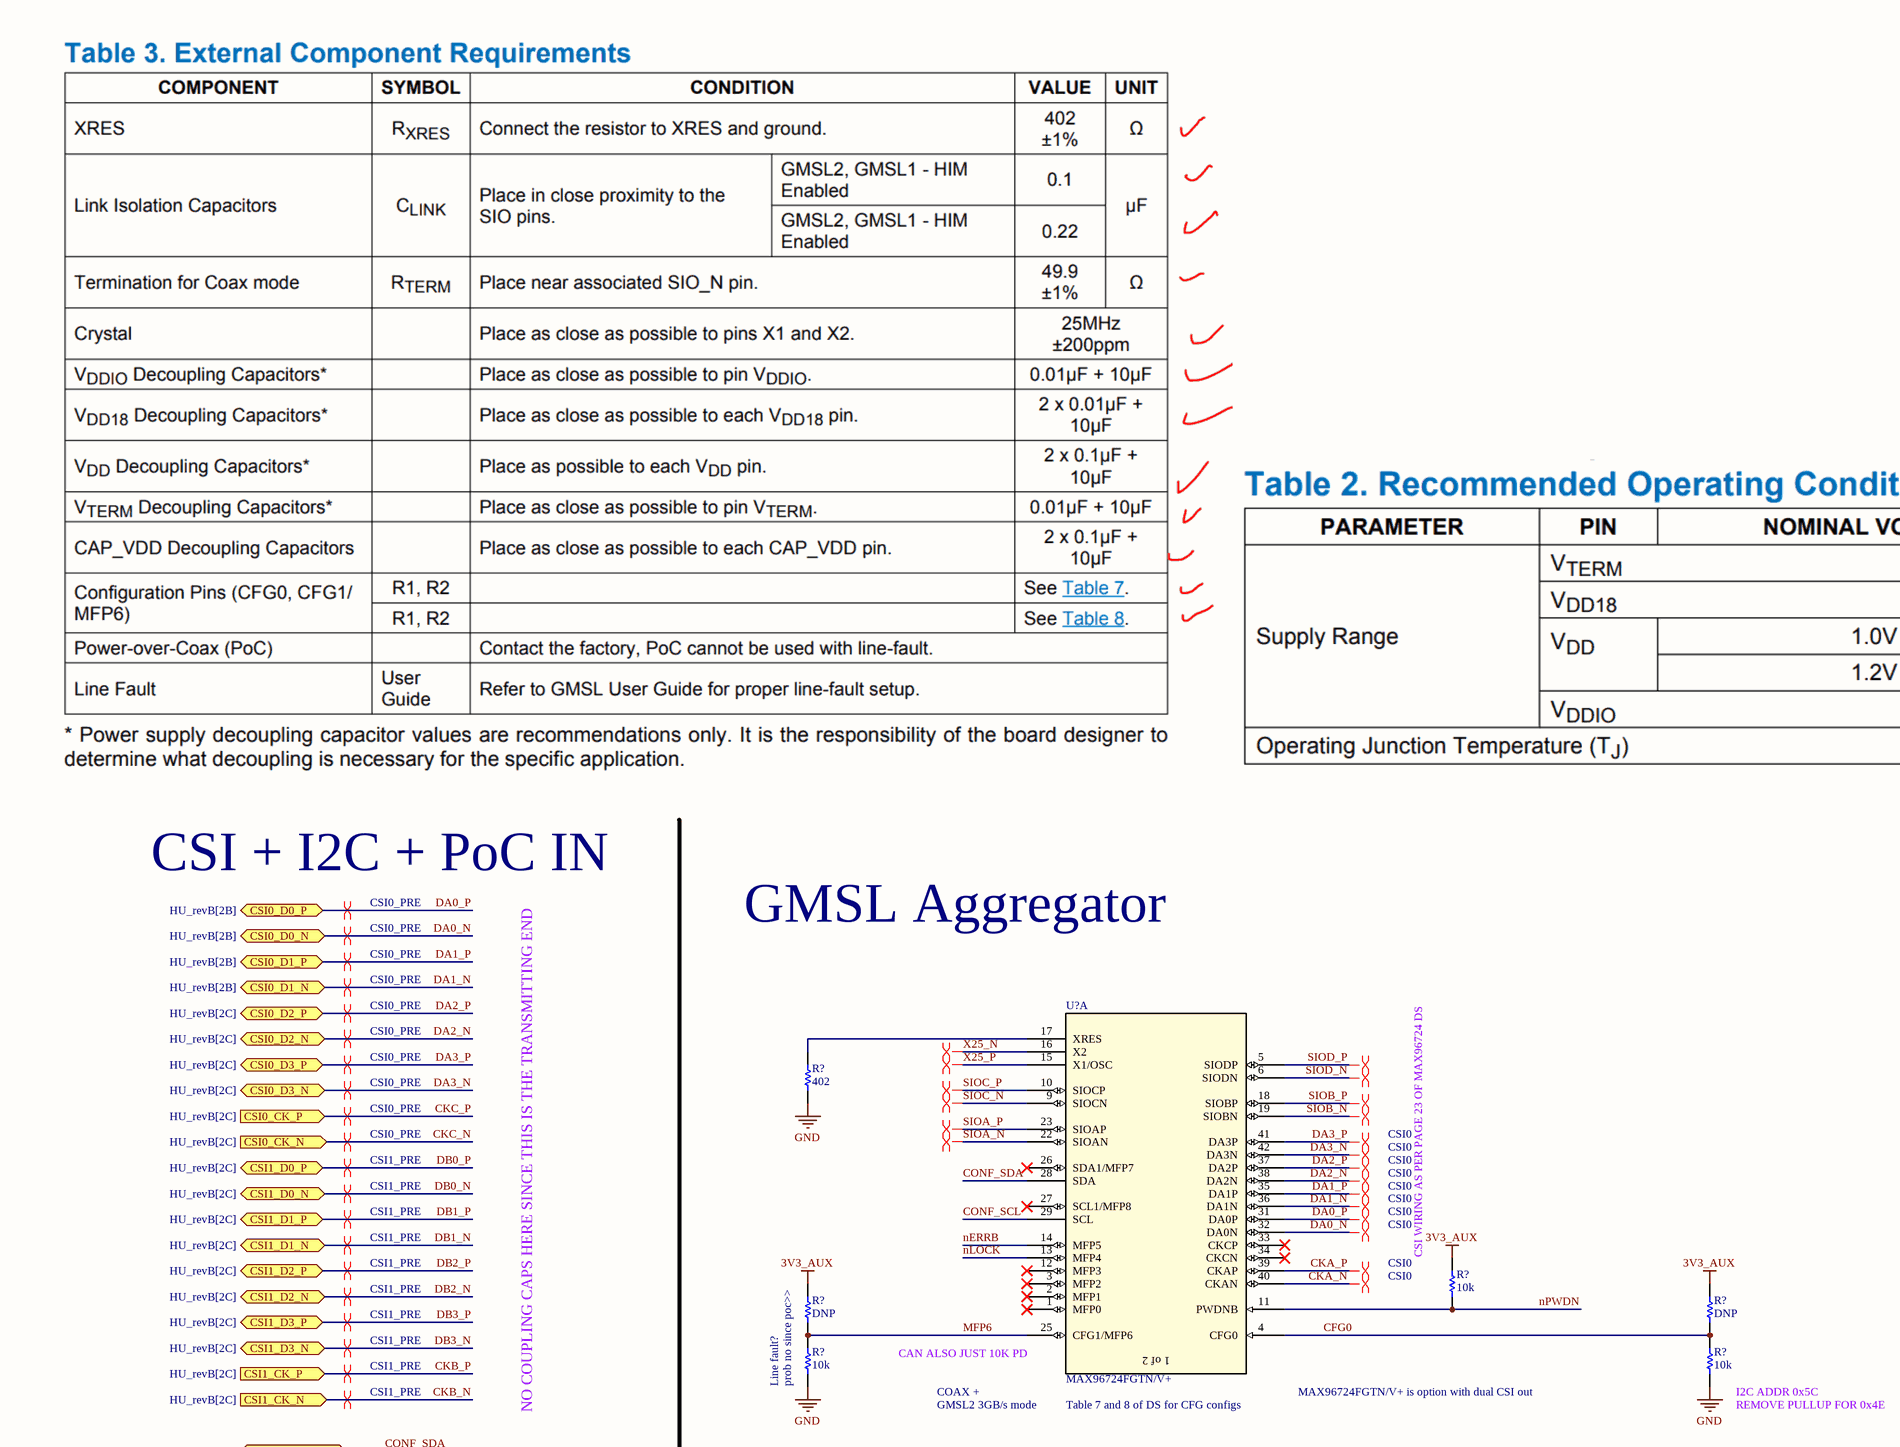
[diagram p15: GMSL_DESERIALIZER.SchDoc, top left]
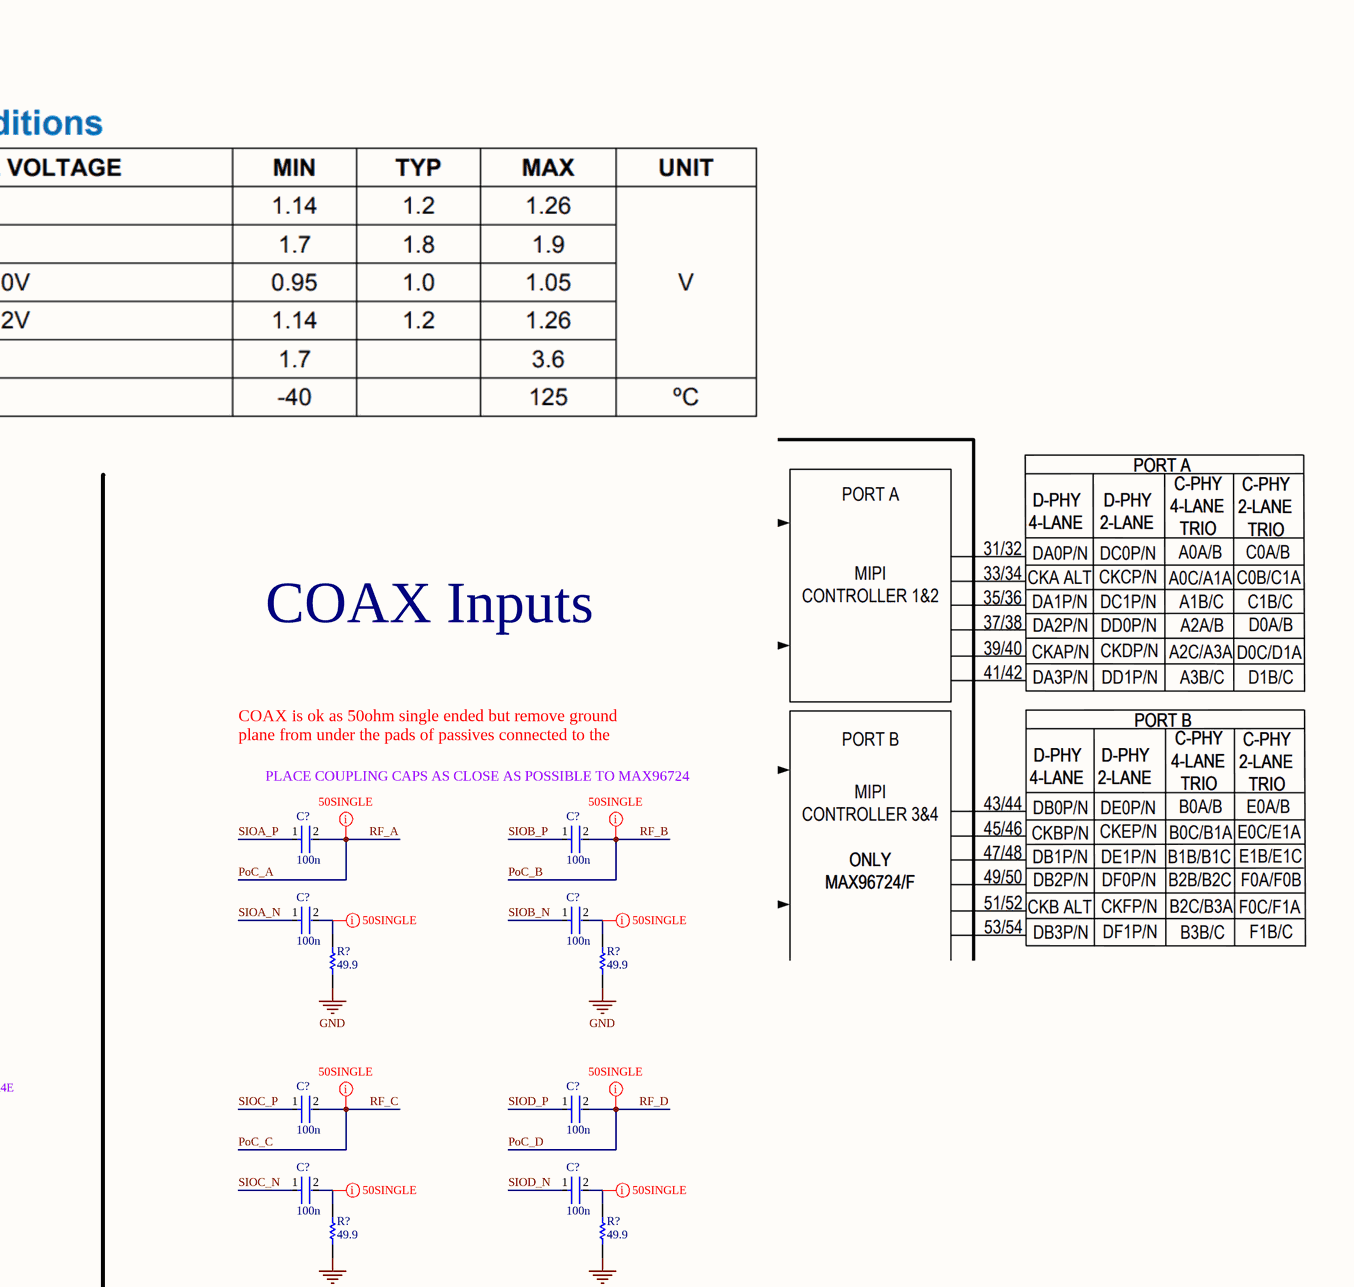
[diagram p16: GMSL_DESERIALIZER.SchDoc, top right]
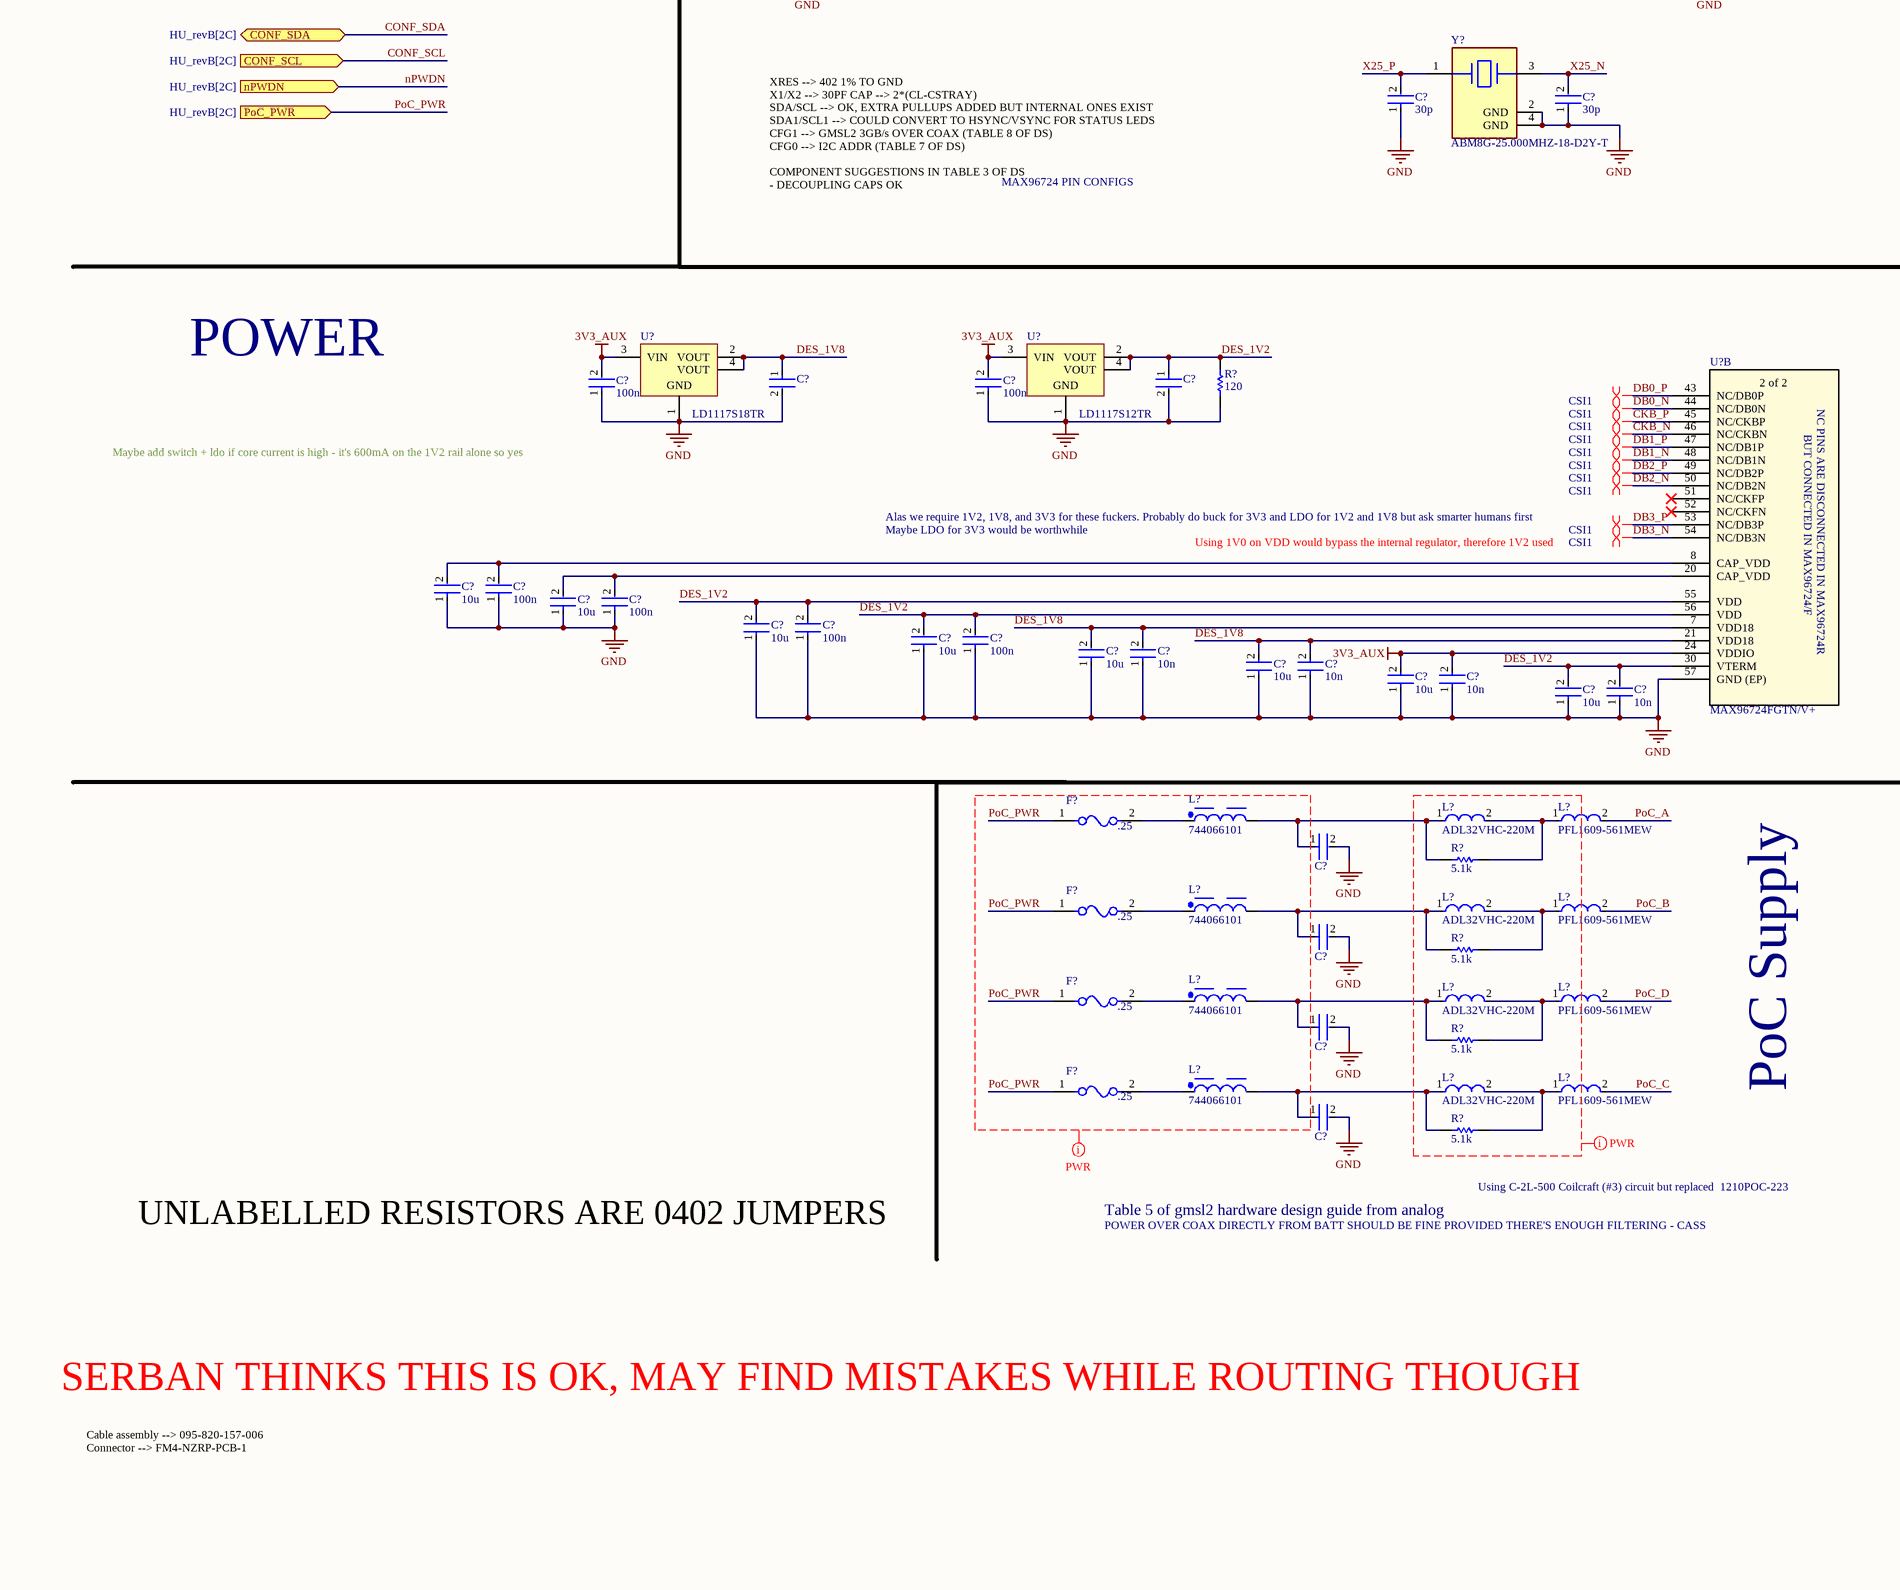
[diagram p17: GMSL_DESERIALIZER.SchDoc, bottom left]
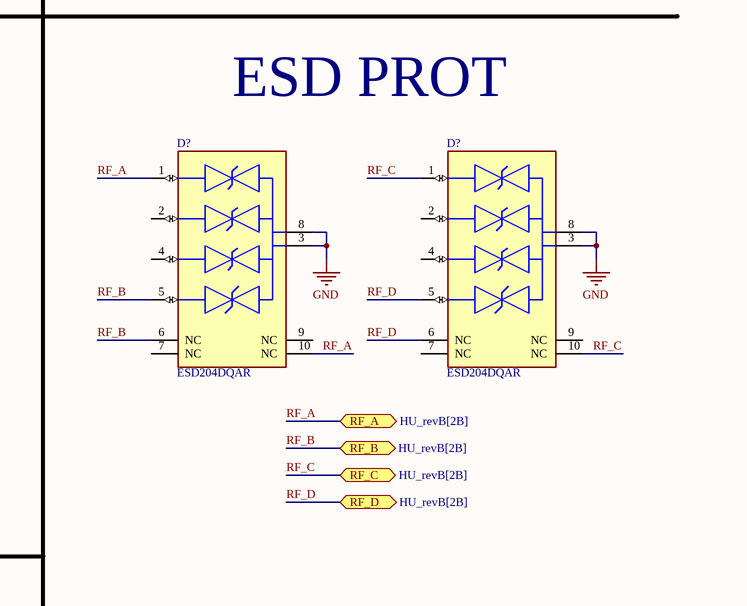
[diagram p18: GMSL_DESERIALIZER.SchDoc, bottom right]

### Parts
(Parts that share a designator on the sheet are numbered #1, #2 ... from top to bottom, then left to right.)
C1  100n  [FP-0402-L_1_0_0_05-W_0_5-IPC_A]
C2  100n  [FP-0402-L_1_0_0_05-W_0_5-IPC_A]
C3  100n  [FP-0402-L_1_0_0_05-W_0_5-IPC_A]
C4  100n  [FP-0402-L_1_0_0_05-W_0_5-IPC_A]
C5  100n  [FP-0402-L_1_0_0_05-W_0_5-IPC_A]
C6  100n  [FP-0402-L_1_0_0_05-W_0_5-IPC_A]
C7  100n  [FP-0402-L_1_0_0_05-W_0_5-IPC_A]
C8#2  100n  [FP-0402-L_1_0_0_05-W_0_5-IPC_A]
C9#2  30p  [FP-0402-L_1_0_0_05-W_0_5-IPC_A]
C10#2  30p  [FP-0402-L_1_0_0_05-W_0_5-IPC_A]
C11#2  100n  [FP-0402-L_1_0_0_05-W_0_5-IPC_A]
C12#2  GRM188R60J106ME47D  [FP-GRM188-0_1-e0_2_0_55-IPC_A]  (value not drawn)
C13#2  100n  [FP-0402-L_1_0_0_05-W_0_5-IPC_A]
C14#2  GRM188R60J106ME47D  [FP-GRM188-0_1-e0_2_0_55-IPC_A]  (value not drawn)
C15  10u  [FP-0402-L_1_0_0_05-W_0_5-IPC_A]
C16  100n  [FP-0402-L_1_0_0_05-W_0_5-IPC_A]
C17#2  10u  [FP-0402-L_1_0_0_05-W_0_5-IPC_A]
C18  100n  [FP-0402-L_1_0_0_05-W_0_5-IPC_A]
C19  10u  [FP-0402-L_1_0_0_05-W_0_5-IPC_A]
C20  100n  [FP-0402-L_1_0_0_05-W_0_5-IPC_A]
C21  10u  [FP-0402-L_1_0_0_05-W_0_5-IPC_A]
C22  100n  [FP-0402-L_1_0_0_05-W_0_5-IPC_A]
C23  10u  [FP-0402-L_1_0_0_05-W_0_5-IPC_A]
C24  10n  [FP-0402-L_1_0_0_05-W_0_5-IPC_A]
C25  10u  [FP-0402-L_1_0_0_05-W_0_5-IPC_A]
C26  10n  [FP-0402-L_1_0_0_05-W_0_5-IPC_A]
C27  10u  [FP-0402-L_1_0_0_05-W_0_5-IPC_A]
C28  10n  [FP-0402-L_1_0_0_05-W_0_5-IPC_A]
C29  10u  [FP-0402-L_1_0_0_05-W_0_5-IPC_A]
C30  10n  [FP-0402-L_1_0_0_05-W_0_5-IPC_A]
C31  GRM21BR61E226ME44L  [FP-GRM21B-0_2-e0_2_0_7-IPC_B]  (value not drawn)
C32  GRM21BR61E226ME44L  [FP-GRM21B-0_2-e0_2_0_7-IPC_B]  (value not drawn)
C33  GRM21BR61E226ME44L  [FP-GRM21B-0_2-e0_2_0_7-IPC_B]  (value not drawn)
C34  GRM21BR61E226ME44L  [FP-GRM21B-0_2-e0_2_0_7-IPC_B]  (value not drawn)
D1#2  ESD204DQAR  [FP-DQA0010A-MFG]
D2#2  ESD204DQAR  [FP-DQA0010A-MFG]
F10  .25  [FP-0685T-MFG]
F11  .25  [FP-0685T-MFG]
F12  .25  [FP-0685T-MFG]
F13  .25  [FP-0685T-MFG]
L1#2  744066101  [WE-TPC_1038]
L2  ADL32VHC-220M  [FP-1210POC-MFG]
L3  PFL1609-561MEW  [FP-PFL1609-MFG]
L4  744066101  [WE-TPC_1038]
L5  ADL32VHC-220M  [FP-1210POC-MFG]
L6  PFL1609-561MEW  [FP-PFL1609-MFG]
L7  744066101  [WE-TPC_1038]
L8  ADL32VHC-220M  [FP-1210POC-MFG]
L9  PFL1609-561MEW  [FP-PFL1609-MFG]
L10  744066101  [WE-TPC_1038]
L11  ADL32VHC-220M  [FP-1210POC-MFG]
L12  PFL1609-561MEW  [FP-PFL1609-MFG]
R1  402  [R0603B]
R2  10k  [R0603B]
R3  49.9  [R0603B]
R4  49.9  [R0603B]
R5  DNP  [R0603B]
R6  DNP  [R0603B]
R7  10k  [R0603B]
R8  10k  [R0603B]
R9  49.9  [R0603B]
R10  49.9  [R0603B]
R11  120  [R0603B]
R12  5.1k  [R0603B]
R13  5.1k  [R0603B]
R14  5.1k  [R0603B]
R15  5.1k  [R0603B]
U1  MAX96724FGTN/V+  [MAX96724FGTN_V+-Footprint-1]  (part B of 2)
U2  LD1117S18TR  [SOT-223_M]
U3  LD1117S12TR  [SOT-223_M]
U?#3  MAX96724FGTN/V+  [MAX96724FGTN_V+-Footprint-1]  (part A of 2)
Y1  ABM8G-25.000MHZ-18-D2Y-T  [FP-ABM8G-MFG]

### Ports
CONF_SCL (in, see HU_revB[2C]), CONF_SDA (bidir, see HU_revB[2C]), CSI0_CK_N (in, see HU_revB[2C]), CSI0_CK_P (in, see HU_revB[2C]), CSI0_D0_N (bidir, see HU_revB[2B]), CSI0_D0_P (bidir, see HU_revB[2B]), CSI0_D1_N (bidir, see HU_revB[2B]), CSI0_D1_P (bidir, see HU_revB[2B]), CSI0_D2_N (bidir, see HU_revB[2C]), CSI0_D2_P (bidir, see HU_revB[2C]), CSI0_D3_N (bidir, see HU_revB[2C]), CSI0_D3_P (bidir, see HU_revB[2C]), CSI1_CK_N (in, see HU_revB[2C]), CSI1_CK_P (in, see HU_revB[2C]), CSI1_D0_N (bidir, see HU_revB[2C]), CSI1_D0_P (bidir, see HU_revB[2C]), CSI1_D1_N (bidir, see HU_revB[2C]), CSI1_D1_P (bidir, see HU_revB[2C]), CSI1_D2_N (bidir, see HU_revB[2C]), CSI1_D2_P (bidir, see HU_revB[2C]), CSI1_D3_N (bidir, see HU_revB[2C]), CSI1_D3_P (bidir, see HU_revB[2C]), nPWDN (in, see HU_revB[2C]), PoC_PWR (in, see HU_revB[2C]), RF_A (bidir, see HU_revB[2B]), RF_B (bidir, see HU_revB[2B]), RF_C (bidir, see HU_revB[2B]), RF_D (bidir, see HU_revB[2B])

### Nets
3V3_AUX: C11#2.2 C13#2.2 C27.2 C28.2 R2.2 R5.2 R6.2 U1.24(VDDIO) U2.3(VIN) U3.3(VIN)  [project net GPIO_VREF]
GND: C9#2.1 C10#2.1 C11#2.1 C12#2.2 C13#2.1 C14#2.2 C15.1 C16.1 C17#2.1 C18.1 C19.1 C20.1 C21.1 C22.1 C23.1 C24.1 C25.1 C26.1 C27.1 C28.1 C29.1 C30.1 C31.2 C32.2 C33.2 C34.2 D1#2.3(GND) D1#2.8(GND) D2#2.3(GND) D2#2.8(GND) R1.1 R3.1 R4.1 R7.1 R8.1 R9.1 R10.1 R11.1 U1.57(GND_(EP)) U2.1(GND) U3.1(GND) Y1.2(GND) Y1.4(GND)
CFG0: R6.1 R8.2 U?#3.4(CFG0)
CKA_N: U?#3.40(CKAN)
CKA_P: U?#3.39(CKAP)
CKB_N: U1.46(NC/CKBN) ; port CSI1_CK_N
CKB_P: U1.45(NC/CKBP) ; port CSI1_CK_P
CONF_SCL: U?#3.29(SCL) ; port CONF_SCL
CONF_SDA: U?#3.28(SDA) ; port CONF_SDA
DA0_N: U?#3.32(DA0N) ; port CSI0_D0_N
DA0_P: U?#3.31(DA0P) ; port CSI0_D0_P
DA1_N: U?#3.36(DA1N) ; port CSI0_D1_N
DA1_P: U?#3.35(DA1P) ; port CSI0_D1_P
DA2_N: U?#3.38(DA2N) ; port CSI0_D2_N
DA2_P: U?#3.37(DA2P) ; port CSI0_D2_P
DA3_N: U?#3.42(DA3N) ; port CSI0_D3_N
DA3_P: U?#3.41(DA3P) ; port CSI0_D3_P
DB0_N: U1.44(NC/DB0N) ; port CSI1_D0_N
DB0_P: U1.43(NC/DB0P) ; port CSI1_D0_P
DB1_N: U1.48(NC/DB1N) ; port CSI1_D1_N
DB1_P: U1.47(NC/DB1P) ; port CSI1_D1_P
DB2_N: U1.50(NC/DB2N) ; port CSI1_D2_N
DB2_P: U1.49(NC/DB2P) ; port CSI1_D2_P
DB3_N: U1.54(NC/DB3N) ; port CSI1_D3_N
DB3_P: U1.53(NC/DB3P) ; port CSI1_D3_P
DES_1V2: C14#2.1 C19.2 C20.2 C21.2 C22.2 C29.2 C30.2 R11.2 U1.30(VTERM) U1.55(VDD) U1.56(VDD) U3.2(VOUT) U3.4(VOUT)
DES_1V8: C12#2.1 C23.2 C24.2 C25.2 C26.2 U1.7(VDD18) U1.21(VDD18) U2.2(VOUT) U2.4(VOUT)
MFP6: R5.1 R7.2 U?#3.25(CFG1/MFP6)
nERRB: U?#3.14(MFP5)
nLOCK: U?#3.13(MFP4)
nPWDN: R2.1 U?#3.11(PWDNB) ; port nPWDN  [project net CAM_GPIO0]
PoC_A: C1.2 D1#2.1(IO1) D1#2.10(NC) L3.2 ; port RF_A  [also labelled RF_A]
PoC_B: C2.2 D1#2.5(IO4) D1#2.6(NC) L6.2 ; port RF_B  [also labelled RF_B]
PoC_C: C5.2 D2#2.1(IO1) D2#2.10(NC) L12.2 ; port RF_C  [also labelled RF_C]
PoC_D: C6.2 D2#2.5(IO4) D2#2.6(NC) L9.2 ; port RF_D  [also labelled RF_D]
PoC_PWR: F10.1 F11.1 F12.1 F13.1 ; port PoC_PWR
SIOA_N: C3.1 U?#3.22(SIOAN)
SIOA_P: C1.1 U?#3.23(SIOAP)
SIOB_N: C4.1 U?#3.19(SIOBN)
SIOB_P: C2.1 U?#3.18(SIOBP)
SIOC_N: C7.1 U?#3.9(SIOCN)
SIOC_P: C5.1 U?#3.10(SIOCP)
SIOD_N: C8#2.1 U?#3.6(SIODN)
SIOD_P: C6.1 U?#3.5(SIODP)
X25_N: C10#2.2 U?#3.16(X2) Y1.3
X25_P: C9#2.2 U?#3.15(X1/OSC) Y1.1
NetC3_2: C3.2 R3.2
NetC4_2: C4.2 R4.2
NetC7_2: C7.2 R9.2
NetC8#2_2: C8#2.2 R10.2
NetC15_2: C15.2 C16.2 U1.8(CAP_VDD)
NetC17#2_2: C17#2.2 C18.2 U1.20(CAP_VDD)
NetC31_1: C31.1 L1#2.2 L2.1 R12.2
NetC32_1: C32.1 L4.2 L5.1 R13.2
NetC33_1: C33.1 L7.2 L8.1 R14.2
NetC34_1: C34.1 L10.2 L11.1 R15.2
NetF10_2: F10.2 L1#2.1
NetF11_2: F11.2 L4.1
NetF12_2: F12.2 L7.1
NetF13_2: F13.2 L10.1
NetL2_2: L2.2 L3.1 R12.1
NetL5_2: L5.2 L6.1 R13.1
NetL8_2: L8.2 L9.1 R14.1
NetL11_2: L11.2 L12.1 R15.1
NetR1_2: R1.2 U?#3.17(XRES)

Not connected (* = marked no-connect by the designer): D1#2 2(IO2) 4(IO3) 7(NC) 9(NC); D2#2 2(IO2) 4(IO3) 7(NC) 9(NC); U1 51(NC/CKFP)* 52(NC/CKFN)*; U?#3 1(MFP0)* 2(MFP1)* 3(MFP2)* 12(MFP3)* 26(SDA1/MFP7)* 27(SCL1/MFP8)* 33(CKCP)* 34(CKCN)*

### Layout directives
differential pair; differential pair class CSI0: CKA_N, CKA_P, DA0_N, DA0_P, DA1_N, DA1_P, DA2_N, DA2_P, DA3_N, DA3_P
differential pair; differential pair class 100DIFF: SIOA_N, SIOA_P, SIOB_N, SIOB_P, SIOC_N, SIOC_P, SIOD_N, SIOD_P
differential pair: X25_N, X25_P
differential pair; differential pair class CSI1: CKB_N, CKB_P, DB0_N, DB0_P, DB1_N, DB1_P, DB2_N, DB2_P, DB3_N, DB3_P
net class PWR: (no net found under the mark), PoC_PWR
differential pair; differential pair class CSI0_PRE: CKC_N, CKC_P, DA0_N, DA0_P, DA1_N, DA1_P, DA2_N, DA2_P, DA3_N, DA3_P
differential pair; differential pair class CSI1_PRE: CKB_N, CKB_P, DB0_N, DB0_P, DB1_N, DB1_P, DB2_N, DB2_P, DB3_N, DB3_P
net class 50SINGLE: NetC3_2, NetC4_2, NetC7_2, NetC8#2_2, PoC_A, PoC_B, PoC_C, PoC_D

### Notes on the sheet
- CSI + I2C + PoC IN
- GMSL Aggregator
- COAX Inputs
- COAX is ok as 50ohm single ended but remove ground plane from under the pads of passives connected to the GMSL trace
- PLACE COUPLING CAPS AS CLOSE AS POSSIBLE TO MAX96724
- (near R2) CSI WIRING AS PER PAGE 23 OF MAX96724 DS
- (near R7) Line fault?
- (near R7) prob no since poc>>
- CAN ALSO JUST 10K PD
- NO COUPLING CAPS HERE SINCE THIS IS THE TRANSMITTING END
- GMSL2 3GB/s mode
- COAX +
- Table 7 and 8 of DS for CFG configs
- MAX96724FGTN/V+ is option with dual CSI out
- (near R8) I2C ADDR 0x5C
- (near R8) REMOVE PULLUP FOR 0x4E
- XRES --> 402 1% TO GND
  X1/X2 --> 30PF CAP --> 2*(CL-CSTRAY)
  SDA/SCL --> OK, EXTRA PULLUPS ADDED BUT INTERNAL ONES EXIST
  SDA1/SCL1 --> COULD CONVERT TO HSYNC/VSYNC FOR STATUS LEDS
  CFG1 --> GMSL2 3GB/s OVER COAX (TABLE 8 OF DS)
  CFG0 --> I2C ADDR (TABLE 7 OF DS)
  COMPONENT SUGGESTIONS IN TABLE 3 OF DS
  - DECOUPLING CAPS OK
- MAX96724 PIN CONFIGS
- ESD PROT
- POWER
- Maybe add switch + ldo if core current is high - it's 600mA on the 1V2 rail alone so yes
- Alas we require 1V2, 1V8, and 3V3 for these fuckers. Probably do buck for 3V3 and LDO for 1V2 and 1V8 but ask smarter humans first
- Maybe LDO for 3V3 would be worthwhile
- Using 1V0 on VDD would bypass the internal regulator, therefore 1V2 used
- PoC Supply
- Using C-2L-500 Coilcraft (#3) circuit but replaced  1210POC-223
- UNLABELLED RESISTORS ARE 0402 JUMPERS
- Table 5 of gmsl2 hardware design guide from analog
- POWER OVER COAX DIRECTLY FROM BATT SHOULD BE FINE PROVIDED THERE'S ENOUGH FILTERING - CASS
- SERBAN THINKS THIS IS OK, MAY FIND MISTAKES WHILE ROUTING THOUGH
- Cable assembly --> 095-820-157-006
  Connector --> FM4-NZRP-PCB-1
- (in symbol CMP-015-00011-2, part A) 1 of 2
- (in symbol CMP-015-00011-2, part B) 2 of 2; NC PINS ARE DISCONNECTED IN MAX96724R; BUT CONNECTED IN MAX96724/F

### Library data of the parts
C1-C7 C8#2 C9#2 C10#2 C11#2 C13#2 C15 C16 C17#2 C18-C30 = CMP-001-00058-1: as C55-C59 on sheet MCP2515_PINOUT; Min Operating Temperature: -55°C; Mounting Technology: Surface Mount; Pins: 2; Case/Package: 0402; RoHS Compliant: Yes; Max Operating Temperature: 85°C
C12#2 C14#2 = CMP-2006-02792-2: Chip Multilayer Ceramic Capacitors for General Purpose, 0603, 10uF, X5R, 15%, 20%, 6.3V; Packaging: Tape and Reel; Voltage Rating (DC): 6.3V; Width: 0.031inch; Termination: SMD/SMT; Dielectric: X5R; Package Quantity: 4000; Voltage Rating: 6.3V; Capacitance: 10uF; Case/Package: 0603; Min Operating Temperature: -55°C; Voltage: 6.3V; Length: 1.6mm; Thickness: 0.035inch; Lead Free: Lead Free; Depth: 0.8mm; Case Code (Imperial): 0603; Max Operating Temperature: 85°C; Material: Ceramic; Height: 0.8mm; Tolerance: 20%; Mount: Surface Mount; REACH SVHC: No SVHC; Radiation Hardening: No; Case Code (Metric): 1608
C31-C34 = CMP-2007-03222-3: Chip Multilayer Ceramic Capacitors for General Purpose, 0805, 22uF, X5R, 15%, 20%, 25V; Case/Package: 0805; Depth: 1.25mm; Resistor Type: Ceramic; Voltage Rating: 25V; Lead Free: Lead Free; Voltage Rating (DC): 25V; Case Code (Metric): 2012; Thickness: 0.057inch; REACH SVHC: No SVHC; Material: Ceramic; Tolerance: 20%; Length: 2mm; Capacitance: 22uF; Case Code (Imperial): 0805; Max Operating Temperature: 85°C; Termination: SMD/SMT; Weight: 0.000335oz; Dielectric: X5R; Packaging: Tape and Reel; Voltage: 25V; Package Quantity: 3000; Height: 1.25mm; Mount: Surface Mount; Width: 1.25mm; Min Operating Temperature: -55°C
D1#2 D2#2 = CMP-04989-000002-1: 4-CHANNEL LOW-CAPACITANCE SURGE; Manufacturer: Texas Instruments; Value: 0.55pF; Reverse Standoff Voltage: 3.6V; Standoff Height: 0mm; Breakdown Voltage: 5.5V; Peak Pulse Current: 5.5A; Clamping Voltage: 11.5V; Direction: Bidirectional; Peak Pulse Power: 50W; Number Of Channels: 4; Ambient Temperature Range High: +125°C; ComponentLink2Description: Datasheet; Height: 0.55mm; Lead Free: Yes; Device Class L3: unset; Temperature Range High: +125°C; Temperature Range Low: -40°C; Package: DQA0010A; Temperature: -40°C to +125°C; Capacitance: 0.55pF; RoHS: TRUE; Mouser Description: 4-Channel Low-Capacitance Surge and ESD Protection Diode 10-USON -40 to 125; Category: Diode; Device Class L1: Circuit Protection; Octopart: https://octopart.com/esd204dqar-texas+instruments-89917476; Device Class L2: TVS Diodes; Ambient Temperature Range Low: -40°C; Manufacturer Part Number: ESD204DQAR; ComponentLink2URL: http://www.ti.com/lit/ds/symlink/esd204.pdf; Automotive: No; Digikey Description: 4-CHANNEL LOW-CAPACITANCE SURGE
F10-F13 = CMP-16042-000006-1: FUSE BOARD MNT 5A 63VAC/VDC 1206; RoHS Compliant: Yes
L1#2 L4 L7 L10 = CMP-0227-00094-3: NexarPartId: 8917123; Current Rating: 1.2A; Shielding: Shielded; Core Material: Ferrite; Inductance: 100µH; Test Frequency: 100kHz; Tolerance: 30%; Resistance: 255mΩ; Self Resonant Frequency: 6MHz; Composition: Wirewound; Packaging: Cut Tape (CT); REACH SVHC: Unknown; Number of Pins: 2; Max DC Current: 1.2A; Saturation Current: 1.2A; Ambient Temperature Range High: 95°C; Weight: 1.273007g; Height: 3.8mm; Width: 10mm; Min Operating Temperature: -40°C; Max Operating Temperature: 125°C; Termination: SMD/SMT; Height - Seated (Max): 4.0894mm; Length: 10mm; RMS Current (Irms): 1.2A; Ambient Temperature Range Low: -40°C; RoHS: Compliant; Mount: Surface Mount; Depth: 10mm; DC Resistance (DCR): 255mΩ; Inductance Tolerance: 30%; Case/Package: Nonstandard
L2 L5 L8 L11 = CMP-11268-000041-1: NOT COILCRAFT - ACTUAL P# --> ADL32VHC-220M / - Power Injection Chokes for PoC; Manufacturer Part Number: 1210POC-223MRC; Value: 22uH; Core Material: Ferrite; Saturation Current: 720mA; Series Resistance: 0.88Ω; Rms Current: 700mA; Automotive Grade: Grade 1; Self Resonant Frequency: 70MHz; Test Frequency: 100kHz; Tolerance: 20%; Ambient Temperature Range High: +125°C; Manufacturer: coilcraft; Octopart: https://octopart.com/1210poc-223mrc-coilcraft-103207315; Category: Ind; Device Class L2: Inductors; RoHS: TRUE; Device Class L3: Fixed Inductors; Package: 1210POC; Ambient Temperature Range Low: -40°C; ComponentLink2URL: https://drive.google.com/open?id=15FlOq8Y4YbRFohfA_cJ40jgnqs8va2Mh; Lead Free: Yes; Inductance: 22uH; Device Class L1: Passive Components; ComponentLink2Description: Datasheet; Automotive: Yes; Height: 3mm
L3 L6 L9 L12 = CMP-11268-000007-1: Fixed Inductors PFL1609 Low Profile 0.56 uH 20 % 1.4 A; Manufacturer: coilcraft; Rms Current: 1100mA; Self Resonant Frequency: 600MHz; Core Material: Composite; Tolerance: 20%; Value: 0.56uH; Automotive Grade: Grade 1; Saturation Current: 710mA; Test Frequency: 7.9MHz; Shielding: true; Series Resistance: 130mΩ; Lead Free: Yes; Device Class L1: Passive Components; Package: PFL1609; Octopart: https://octopart.com/pfl1609-561mew-coilcraft-20329171; ComponentLink2URL: https://www.coilcraft.com/pdfs/pfl1609.pdf; Manufacturer Part Number: PFL1609-561MEW; Ambient Temperature Range Low: -40°C; Composition: Wirewound; Inductance: 0.56uH; Device Class L2: Inductors; Category: Ind; Device Class L3: Fixed Inductors; Mouser Description: Fixed Inductors PFL1609 Low Profile 0.56 uH 20 % 1.4 A; Automotive: Yes; ComponentLink2Description: Datasheet; Ambient Temperature Range High: +105°C; Height: 0.95mm; RoHS: TRUE
R1-R15 = CMP-009-00002-14: Resistor
U1 U?#3 = CMP-015-00011-2: Quad Tunneling GMSL2/1 to CSI-2 Deserializer
U2 = CMP-0244-00308-1: Fixed Low Drop Positive Voltage Regulator, 1.8V, 4-Pin SOT-223, Tape and Reel; ComponentLink1URL: http://www.st.com; PackageReference: SOT-223; PackageDescription: 4-Pin SOT-223 Package, 6.5 x 3.5 mm Body, 2.3 mm Pitch, 7 mm Lead Span; ComponentLink2URL: http://www.st.com/internet/com/TECHNICAL_RESOURCES/TECHNICAL_LITERATURE/DATASHEET/CD00000544.pdf; ComponentLink2Description: Datasheet; ComponentLink1Description: Manufacturer URL; DatasheetVersion: 1/11/2011; PackageVersion: 2010
U3 = CMP-0244-00318-1: Fixed Low Drop Positive Voltage Regulator, 1.2V, 4-Pin SOT-223, Tape and Reel; PackageDescription: 4-Pin SOT-223 Package, 6.5 x 3.5 mm Body, 2.3 mm Pitch, 7 mm Lead Span; PackageVersion: 2010; ComponentLink2Description: Datasheet; PackageReference: SOT-223; ComponentLink2URL: http://www.st.com/internet/com/TECHNICAL_RESOURCES/TECHNICAL_LITERATURE/DATASHEET/CD00000544.pdf; ComponentLink1Description: Manufacturer URL; DatasheetVersion: 1/11/2011; ComponentLink1URL: http://www.st.com
Y1 = CMP-2000-05733-3: Crystal 25MHz ±20ppm (Tol) ±30ppm (Stability) 18pF FUND 60Ω 4-Pin SMD T/R; Series Resistance: 60R; Length: 3.2mm; Depth: 2.5mm; Packaging: Tape and Reel; Min Operating Temperature: -40°C; Operating Frequency: 25 MHz; Lead Free: Lead Free; Number of Pins: 4; Frequency Tolerance: 20ppm; Radiation Hardening: No; Max Operating Temperature: 85°C; Termination: SMD/SMT; Frequency Stability: 30ppm; Frequency: 25MHz; Series: ABM8G; Mount: Surface Mount; Package Quantity: 1000; Height: 0.039inch; Width: 0.098inch; Case/Package: CSMD; ESR (Equivalent Series Resistance): 60R; Load Capacitance: 18pF; Tolerance: 20ppm